# EAGLE design elasticNode (EAGLE 8.2.2)

## Sheet 1 of 4
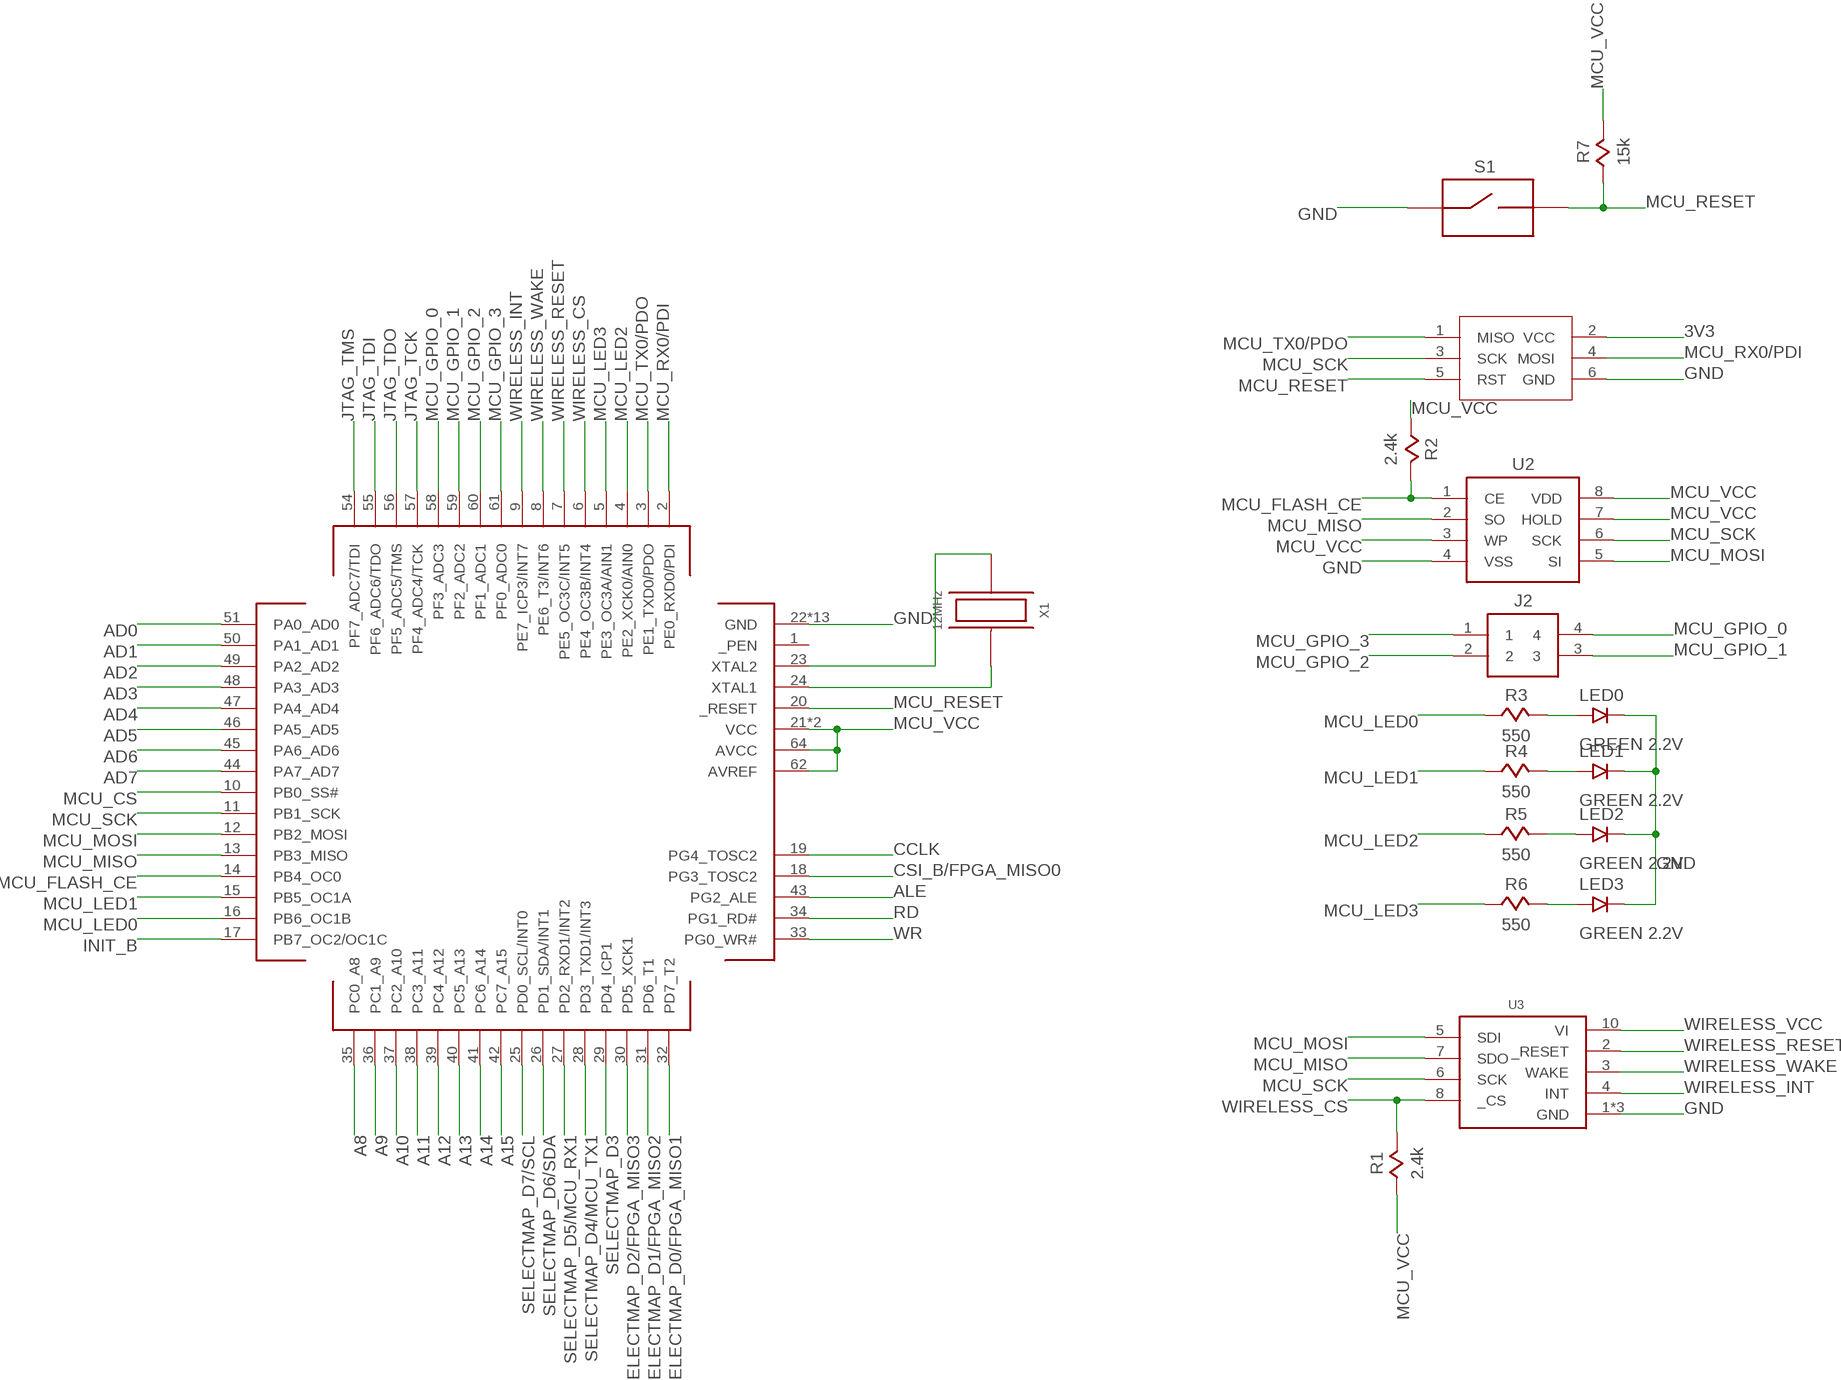
[diagram p0: schematic, sheet 1]

### Parts
J1  ISP_CONN_6PIN  [3X2_HEADER_SMT]
J2  FEMALE_HEADER_2X2  [2X2_HEADER]
LED0  GREEN 2.2V  LED  [0805]
LED1  GREEN 2.2V  LED  [0805]
LED2  GREEN 2.2V  LED  [0805]
LED3  GREEN 2.2V  LED  [0805]
R1  2.4k  RESISTOR  [0805]
R2  2.4k  RESISTOR  [0805]
R3  550  RESISTOR  [0805]
R4  550  RESISTOR  [0805]
R5  550  RESISTOR  [0805]
R6  550  RESISTOR  [0805]
R7  15k  RESISTOR  [0805]
S1  SPST_BUTTON2PIN_SMT  [SPST_2PIN_SMT]
U1  ATMEGA64AQFN  [QFN64]
U2  SST26VF032B  [SOIC8]
U3  MRF24J40MA  [MRF24J40MA]
X1  12MHz  QUARTZ  [3.2X2.5_OSC]

### Nets
3V3 [power]: J1.2(VCC) ; also sheet 2,3,4
A8: U1.35(PC0_A8) ; also sheet 2
A9: U1.36(PC1_A9) ; also sheet 2
A10: U1.37(PC2_A10) ; also sheet 2
A11: U1.38(PC3_A11) ; also sheet 2
A12: U1.39(PC4_A12) ; also sheet 2
A13: U1.40(PC5_A13) ; also sheet 2
A14: U1.41(PC6_A14) ; also sheet 2
A15: U1.42(PC7_A15) ; also sheet 2
AD0: U1.51(PA0_AD0) ; also sheet 2
AD1: U1.50(PA1_AD1) ; also sheet 2
AD2: U1.49(PA2_AD2) ; also sheet 2
AD3: U1.48(PA3_AD3) ; also sheet 2
AD4: U1.47(PA4_AD4) ; also sheet 2
AD5: U1.46(PA5_AD5) ; also sheet 2
AD6: U1.45(PA6_AD6) ; also sheet 2
AD7: U1.44(PA7_AD7) ; also sheet 2
ALE: U1.43(PG2_ALE) ; also sheet 2
CCLK: U1.19(PG4_TOSC2) ; also sheet 2
CSI_B/FPGA_MISO0: U1.18(PG3_TOSC2) ; also sheet 2
GND: J1.6(GND) LED0.2 LED1.2 LED2.2 LED3.2 S1.1 U1.22(GND) U1.53(GND) U1.63(GND) U1.PAD(GND) U1.VIA1(GND) U1.VIA2(GND) U1.VIA3(GND) U1.VIA4(GND) U1.VIA5(GND) U1.VIA6(GND) U1.VIA7(GND) U1.VIA8(GND) U1.VIA9(GND) U2.4(VSS) U3.1(GND) U3.11(GND) U3.12(GND) ; also sheet 2,3,4
INIT_B: U1.17(PB7_OC2/OC1C) ; also sheet 2
JTAG_TCK: U1.57(PF4_ADC4/TCK) ; also sheet 2
JTAG_TDI: U1.55(PF6_ADC6/TDO) ; also sheet 2
JTAG_TDO: U1.56(PF5_ADC5/TMS) ; also sheet 2
JTAG_TMS: U1.54(PF7_ADC7/TDI) ; also sheet 2
MCU_CS: U1.10(PB0_SS#)
MCU_FLASH_CE: R2.2 U1.14(PB4_OC0) U2.1(CE)
MCU_GPIO_0: J2.4 U1.58(PF3_ADC3)
MCU_GPIO_1: J2.3 U1.59(PF2_ADC2)
MCU_GPIO_2: J2.2 U1.60(PF1_ADC1)
MCU_GPIO_3: J2.1 U1.61(PF0_ADC0)
MCU_LED0: R3.1 U1.16(PB6_OC1B)
MCU_LED1: R4.1 U1.15(PB5_OC1A)
MCU_LED2: R5.1 U1.4(PE2_XCK0/AIN0)
MCU_LED3: R6.1 U1.5(PE3_OC3A/AIN1)
MCU_MISO: U1.13(PB3_MISO) U2.2(SO) U3.7(SDO)
MCU_MOSI: U1.12(PB2_MOSI) U2.5(SI) U3.5(SDI)
MCU_RESET: J1.5(RST) R7.1 S1.2 U1.20(_RESET)
MCU_RX0/PDI: J1.4(MOSI) U1.2(PE0_RXD0/PDI) ; also sheet 4
MCU_SCK: J1.3(SCK) U1.11(PB1_SCK) U2.6(SCK) U3.6(SCK)
MCU_TX0/PDO: J1.1(MISO) U1.3(PE1_TXD0/PDO) ; also sheet 4
MCU_VCC: R1.1 R2.1 R7.2 U1.21(VCC) U1.52(VCC) U1.62(AVREF) U1.64(AVCC) U2.3(WP) U2.7(HOLD) U2.8(VDD) ; also sheet 3
N$13: LED3.1 R6.2
N$15: LED2.1 R5.2
N$23: LED1.1 R4.2
N$24: LED0.1 R3.2
N$38: U1.23(XTAL2) X1.2
N$39: U1.24(XTAL1) X1.4
RD: U1.34(PG1_RD#) ; also sheet 2
SELECTMAP_D0/FPGA_MISO1: U1.32(PD7_T2) ; also sheet 2
SELECTMAP_D1/FPGA_MISO2: U1.31(PD6_T1) ; also sheet 2
SELECTMAP_D2/FPGA_MISO3: U1.30(PD5_XCK1) ; also sheet 2
SELECTMAP_D3: U1.29(PD4_ICP1) ; also sheet 2
SELECTMAP_D4/MCU_TX1: U1.28(PD3_TXD1/INT3) ; also sheet 2
SELECTMAP_D5/MCU_RX1: U1.27(PD2_RXD1/INT2) ; also sheet 2
SELECTMAP_D6/SDA: U1.26(PD1_SDA/INT1) ; also sheet 2,3
SELECTMAP_D7/SCL: U1.25(PD0_SCL/INT0) ; also sheet 2,3
WIRELESS_CS: R1.2 U1.6(PE4_OC3B/INT4) U3.8(_CS)
WIRELESS_INT: U1.9(PE7_ICP3/INT7) U3.4(INT)
WIRELESS_RESET: U1.7(PE5_OC3C/INT5) U3.2(_RESET)
WIRELESS_VCC [power]: U3.10(VI) ; also sheet 3
WIRELESS_WAKE: U1.8(PE6_T3/INT6) U3.3(WAKE)
WR: U1.33(PG0_WR#) ; also sheet 2
Unconnected: U1.1(_PEN)

## Sheet 2 of 4
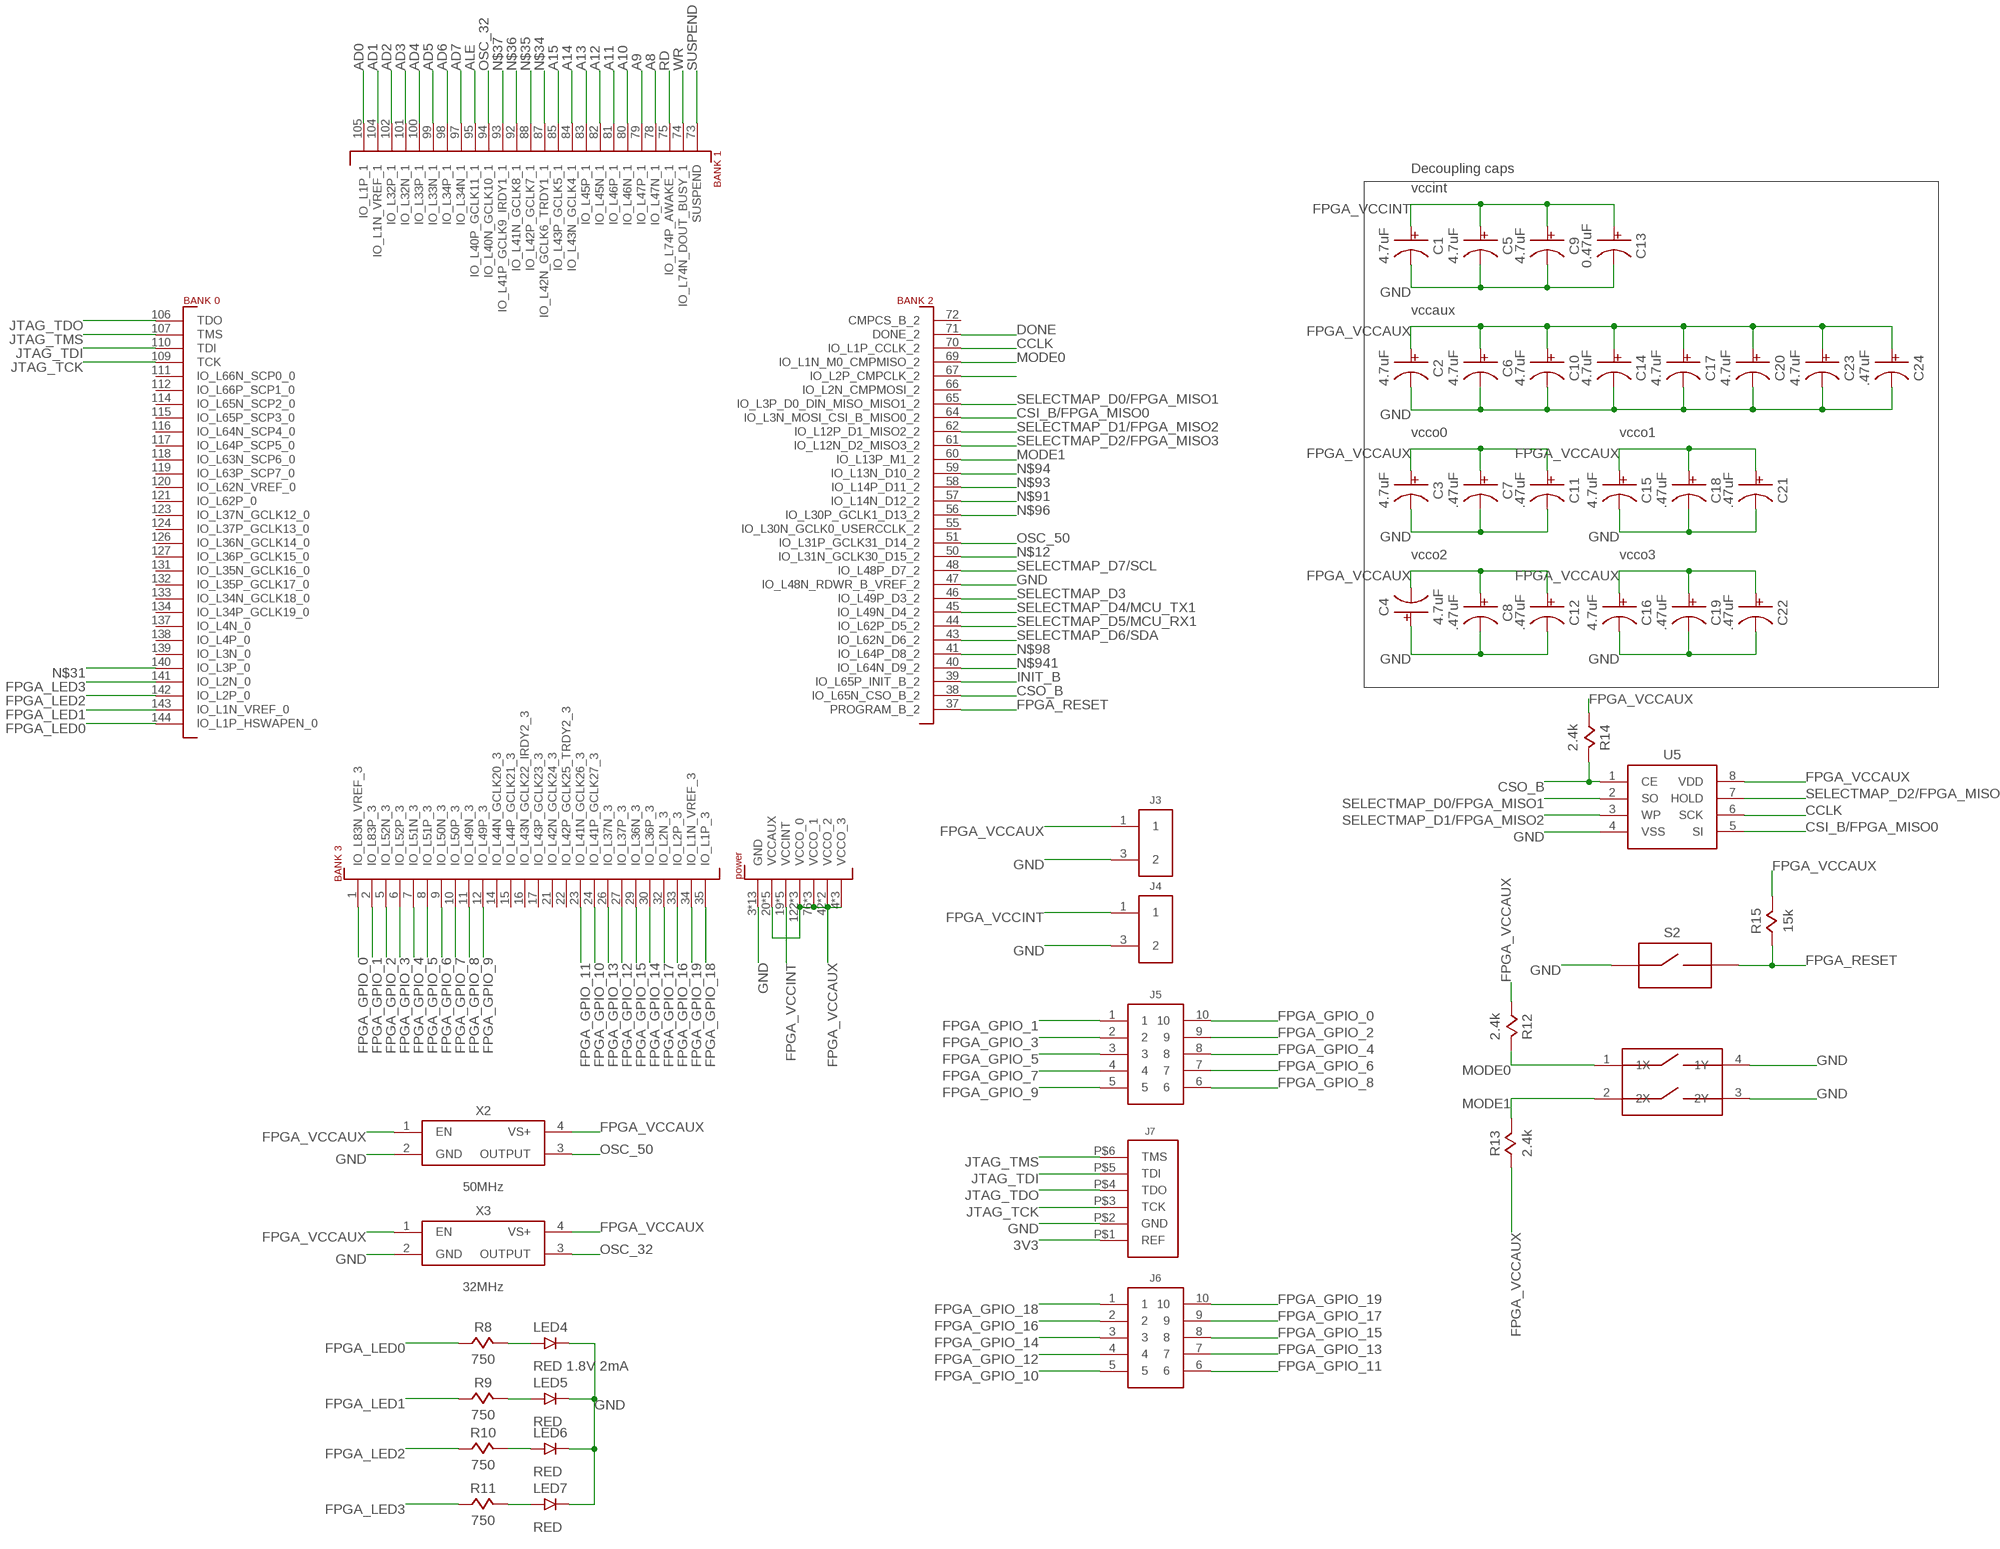
[diagram p1: schematic, sheet 2]

### Parts
C1  4.7uF  CAPACITOR0805  [0805]
C2  4.7uF  CAPACITOR0805  [0805]
C3  4.7uF  CAPACITOR0805  [0805]
C4  4.7uF  CAPACITOR0805  [0805]
C5  4.7uF  CAPACITOR0805  [0805]
C6  4.7uF  CAPACITOR0805  [0805]
C7  .47uF  CAPACITOR0402  [0402]
C8  .47uF  CAPACITOR0402  [0402]
C9  4.7uF  CAPACITOR0805  [0805]
C10  4.7uF  CAPACITOR0805  [0805]
C11  .47uF  CAPACITOR0402  [0402]
C12  .47uF  CAPACITOR0402  [0402]
C13  0.47uF  CAPACITOR0402  [0402]
C14  4.7uF  CAPACITOR0805  [0805]
C15  4.7uF  CAPACITOR0805  [0805]
C16  4.7uF  CAPACITOR0805  [0805]
C17  4.7uF  CAPACITOR0805  [0805]
C18  .47uF  CAPACITOR0402  [0402]
C19  .47uF  CAPACITOR0402  [0402]
C20  4.7uF  CAPACITOR0805  [0805]
C21  .47uF  CAPACITOR0402  [0402]
C22  .47uF  CAPACITOR0402  [0402]
C23  4.7uF  CAPACITOR0805  [0805]
C24  .47uF  CAPACITOR0805  [0805]
J3  FEMALE_HEADER_2X1  [2X1_HEADER]
J4  FEMALE_HEADER_2X1  [2X1_HEADER]
J5  FEMALE_HEADER_5X2  [5X2_HEADER]
J6  FEMALE_HEADER_5X2  [5X2_HEADER]
J7  JTAG_CONN_6PINTHT  [6X1_HEADER]
LED4  RED 1.8V 2mA  LED  [0805]
LED5  RED  LED  [0805]
LED6  RED  LED  [0805]
LED7  RED  LED  [0805]
R8  750  RESISTOR  [0805]
R9  750  RESISTOR  [0805]
R10  750  RESISTOR  [0805]
R11  750  RESISTOR  [0805]
R12  2.4k  RESISTOR  [0805]
R13  2.4k  RESISTOR  [0805]
R14  2.4k  RESISTOR  [0805]
R15  15k  RESISTOR  [0805]
S2  SPST_BUTTON2PIN_SMT  [SPST_2PIN_SMT]
S3  SPST_DIP_2SMT  [SPST_DIP2_SMT]
U4  SPARTAN6-LX9  [TQG144]
U5  SST26VF032B  [SOIC8]
X2  50MHz  OSCILLATOR3.2X2.5  [3.2X2.5_OSC]
X3  32MHz  OSCILLATOR3.2X2.5  [3.2X2.5_OSC]

### Nets
3V3 [power]: J7.P$1(REF) ; also sheet 1,3,4
A8: U4.78(IO_L47N_1) ; also sheet 1
A9: U4.79(IO_L47P_1) ; also sheet 1
A10: U4.80(IO_L46N_1) ; also sheet 1
A11: U4.81(IO_L46P_1) ; also sheet 1
A12: U4.82(IO_L45N_1) ; also sheet 1
A13: U4.83(IO_L45P_1) ; also sheet 1
A14: U4.84(IO_L43N_GCLK4_1) ; also sheet 1
A15: U4.85(IO_L43P_GCLK5_1) ; also sheet 1
AD0: U4.105(IO_L1P_1) ; also sheet 1
AD1: U4.104(IO_L1N_VREF_1) ; also sheet 1
AD2: U4.102(IO_L32P_1) ; also sheet 1
AD3: U4.101(IO_L32N_1) ; also sheet 1
AD4: U4.100(IO_L33P_1) ; also sheet 1
AD5: U4.99(IO_L33N_1) ; also sheet 1
AD6: U4.98(IO_L34P_1) ; also sheet 1
AD7: U4.97(IO_L34N_1) ; also sheet 1
ALE: U4.95(IO_L40P_GCLK11_1) ; also sheet 1
CCLK: U4.70(IO_L1P_CCLK_2) U5.6(SCK) ; also sheet 1
CSI_B/FPGA_MISO0: U4.64(IO_L3N_MOSI_CSI_B_MISO0_2) U5.5(SI) ; also sheet 1
CSO_B: R14.2 U4.38(IO_L65N_CSO_B_2) U5.1(CE)
DONE: U4.71(DONE_2)
FPGA_GPIO_0: J5.10 U4.1(IO_L83N_VREF_3)
FPGA_GPIO_1: J5.1 U4.2(IO_L83P_3)
FPGA_GPIO_2: J5.9 U4.5(IO_L52N_3)
FPGA_GPIO_3: J5.2 U4.6(IO_L52P_3)
FPGA_GPIO_4: J5.8 U4.7(IO_L51N_3)
FPGA_GPIO_5: J5.3 U4.8(IO_L51P_3)
FPGA_GPIO_6: J5.7 U4.9(IO_L50N_3)
FPGA_GPIO_7: J5.4 U4.10(IO_L50P_3)
FPGA_GPIO_8: J5.6 U4.11(IO_L49N_3)
FPGA_GPIO_9: J5.5 U4.12(IO_L49P_3)
FPGA_GPIO_10: J6.5 U4.24(IO_L41P_GCLK27_3)
FPGA_GPIO_11: J6.6 U4.23(IO_L41N_GCLK26_3)
FPGA_GPIO_12: J6.4 U4.27(IO_L37P_3)
FPGA_GPIO_13: J6.7 U4.26(IO_L37N_3)
FPGA_GPIO_14: J6.3 U4.30(IO_L36P_3)
FPGA_GPIO_15: J6.8 U4.29(IO_L36N_3)
FPGA_GPIO_16: J6.2 U4.33(IO_L2P_3)
FPGA_GPIO_17: J6.9 U4.32(IO_L2N_3)
FPGA_GPIO_18: J6.1 U4.35(IO_L1P_3)
FPGA_GPIO_19: J6.10 U4.34(IO_L1N_VREF_3)
FPGA_LED0: R8.1 U4.144(IO_L1P_HSWAPEN_0)
FPGA_LED1: R9.1 U4.143(IO_L1N_VREF_0)
FPGA_LED2: R10.1 U4.142(IO_L2P_0)
FPGA_LED3: R11.1 U4.141(IO_L2N_0)
FPGA_RESET: R15.1 S2.2 U4.37(PROGRAM_B_2)
FPGA_VCCAUX: C2.1 C3.1 C4.2 C6.1 C7.1 C8.1 C10.1 C11.1 C12.1 C14.1 C15.1 C16.1 C17.1 C18.1 C19.1 C20.1 C21.1 C22.1 C23.1 C24.1 J3.1 R12.1 R13.1 R14.1 R15.2 U4.4(VCCO_3) U4.18(VCCO_3) U4.20(VCCAUX) U4.31(VCCO_3) U4.36(VCCAUX) U4.42(VCCO_2) U4.53(VCCAUX) U4.63(VCCO_2) U4.76(VCCO_1) U4.86(VCCO_1) U4.90(VCCAUX) U4.103(VCCO_1) U4.122(VCCO_0) U4.125(VCCO_0) U4.129(VCCAUX) U4.135(VCCO_0) U5.8(VDD) X2.1(EN) X2.4(VS+) X3.1(EN) X3.4(VS+) ; also sheet 3
FPGA_VCCINT [power]: C1.1 C5.1 C9.1 C13.1 J4.1 U4.19(VCCINT) U4.28(VCCINT) U4.52(VCCINT) U4.89(VCCINT) U4.128(VCCINT) ; also sheet 3
GND: C1.2 C2.2 C3.2 C4.1 C5.2 C6.2 C7.2 C8.2 C9.2 C10.2 C11.2 C12.2 C13.2 C14.2 C15.2 C16.2 C17.2 C18.2 C19.2 C20.2 C21.2 C22.2 C23.2 C24.2 J3.3 J4.3 J7.P$2(GND) LED4.2 LED5.2 LED6.2 LED7.2 S2.1 S3.3(2Y) S3.4(1Y) U4.3(GND) U4.13(GND) U4.25(GND) U4.47(IO_L48N_RDWR_B_VREF_2) U4.49(GND) U4.54(GND) U4.68(GND) U4.77(GND) U4.91(GND) U4.96(GND) U4.108(GND) U4.113(GND) U4.130(GND) U4.136(GND) U5.4(VSS) X2.2(GND) X3.2(GND) ; also sheet 1,3,4
INIT_B: U4.39(IO_L65P_INIT_B_2) ; also sheet 1
JTAG_TCK: J7.P$3(TCK) U4.109(TCK) ; also sheet 1
JTAG_TDI: J7.P$5(TDI) U4.110(TDI) ; also sheet 1
JTAG_TDO: J7.P$4(TDO) U4.106(TDO) ; also sheet 1
JTAG_TMS: J7.P$6(TMS) U4.107(TMS) ; also sheet 1
MODE0: R12.2 S3.1(1X) U4.69(IO_L1N_M0_CMPMISO_2)
MODE1: R13.2 S3.2(2X) U4.60(IO_L13P_M1_2)
N$9: U4.67(IO_L2P_CMPCLK_2)
N$12: U4.50(IO_L31N_GCLK30_D15_2)
N$25: LED7.1 R11.2
N$27: LED6.1 R10.2
N$29: LED5.1 R9.2
N$30: LED4.1 R8.2
N$31: U4.140(IO_L3P_0)
N$34: U4.87(IO_L42N_GCLK6_TRDY1_1)
N$35: U4.88(IO_L42P_GCLK7_1)
N$36: U4.92(IO_L41N_GCLK8_1)
N$37: U4.93(IO_L41P_GCLK9_IRDY1_1)
N$91: U4.57(IO_L14N_D12_2)
N$93: U4.58(IO_L14P_D11_2)
N$94: U4.59(IO_L13N_D10_2)
N$96: U4.56(IO_L30P_GCLK1_D13_2)
N$98: U4.41(IO_L64P_D8_2)
N$941: U4.40(IO_L64N_D9_2)
OSC_32: U4.94(IO_L40N_GCLK10_1) X3.3(OUTPUT)
OSC_50: U4.51(IO_L31P_GCLK31_D14_2) X2.3(OUTPUT)
RD: U4.75(IO_L74P_AWAKE_1) ; also sheet 1
SELECTMAP_D0/FPGA_MISO1: U4.65(IO_L3P_D0_DIN_MISO_MISO1_2) U5.2(SO) ; also sheet 1
SELECTMAP_D1/FPGA_MISO2: U4.62(IO_L12P_D1_MISO2_2) U5.3(WP) ; also sheet 1
SELECTMAP_D2/FPGA_MISO3: U4.61(IO_L12N_D2_MISO3_2) U5.7(HOLD) ; also sheet 1
SELECTMAP_D3: U4.46(IO_L49P_D3_2) ; also sheet 1
SELECTMAP_D4/MCU_TX1: U4.45(IO_L49N_D4_2) ; also sheet 1
SELECTMAP_D5/MCU_RX1: U4.44(IO_L62P_D5_2) ; also sheet 1
SELECTMAP_D6/SDA: U4.43(IO_L62N_D6_2) ; also sheet 1,3
SELECTMAP_D7/SCL: U4.48(IO_L48P_D7_2) ; also sheet 1,3
SUSPEND: U4.73(SUSPEND)
WR: U4.74(IO_L74N_DOUT_BUSY_1) ; also sheet 1
Unconnected: U4.14(IO_L44N_GCLK20_3) U4.15(IO_L44P_GCLK21_3) U4.16(IO_L43N_GCLK22_IRDY2_3) U4.17(IO_L43P_GCLK23_3) U4.21(IO_L42N_GCLK24_3) U4.22(IO_L42P_GCLK25_TRDY2_3) U4.55(IO_L30N_GCLK0_USERCCLK_2) U4.66(IO_L2N_CMPMOSI_2) U4.72(CMPCS_B_2) U4.111(IO_L66N_SCP0_0) U4.112(IO_L66P_SCP1_0) U4.114(IO_L65N_SCP2_0) U4.115(IO_L65P_SCP3_0) U4.116(IO_L64N_SCP4_0) U4.117(IO_L64P_SCP5_0) U4.118(IO_L63N_SCP6_0) U4.119(IO_L63P_SCP7_0) U4.120(IO_L62N_VREF_0) U4.121(IO_L62P_0) U4.123(IO_L37N_GCLK12_0) U4.124(IO_L37P_GCLK13_0) U4.126(IO_L36N_GCLK14_0) U4.127(IO_L36P_GCLK15_0) U4.131(IO_L35N_GCLK16_0) U4.132(IO_L35P_GCLK17_0) U4.133(IO_L34N_GCLK18_0) U4.134(IO_L34P_GCLK19_0) U4.137(IO_L4N_0) U4.138(IO_L4P_0) U4.139(IO_L3N_0)

### Notes on the sheet
- Decoupling caps
- vccint
- vccaux
- vcco0 | vcco1
- vcco2 | vcco3

## Sheet 3 of 4
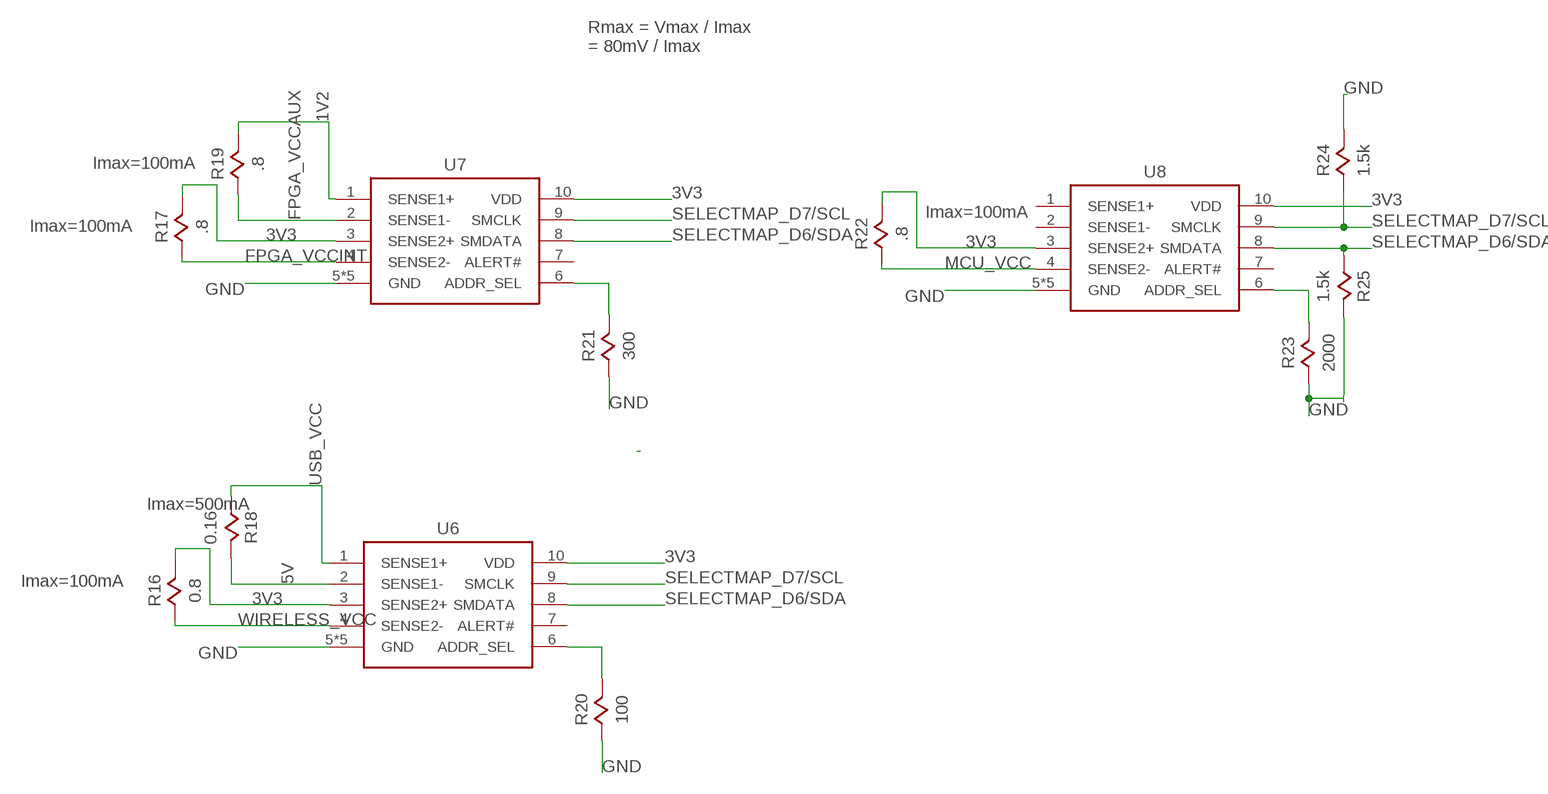
[diagram p2: schematic, sheet 3]

### Parts
R16  0.8  RESISTOR  [0805]
R17  .8  RESISTOR  [0805]
R18  0.16  RESISTOR  [0805]
R19  .8  RESISTOR  [0805]
R20  100  RESISTOR  [0805]
R21  300  RESISTOR  [0805]
R22  .8  RESISTOR  [0805]
R23  2000  RESISTOR  [0805]
R24  1.5k  RESISTOR  [0805]
R25  1.5k  RESISTOR  [0805]
U6  PAC1720  [VDFN10]
U7  PAC1720  [VDFN10]
U8  PAC1720  [VDFN10]

### Nets
1V2 [power]: R19.2 U7.1(SENSE1+) ; also sheet 4
3V3 [power]: R16.2 R17.2 R22.2 U6.3(SENSE2+) U6.10(VDD) U7.3(SENSE2+) U7.10(VDD) U8.3(SENSE2+) U8.10(VDD) ; also sheet 1,2,4
5V [power]: R18.2 U6.2(SENSE1-) ; also sheet 4
FPGA_VCCAUX: R19.1 U7.2(SENSE1-) ; also sheet 2
FPGA_VCCINT [power]: R17.1 U7.4(SENSE2-) ; also sheet 2
GND: R20.1 R21.1 R23.1 R24.2 U6.5(GND) U6.P$1(GND) U6.P$2(GND) U6.P$3(GND) U6.P$4(GND) U7.5(GND) U7.P$1(GND) U7.P$2(GND) U7.P$3(GND) U7.P$4(GND) U8.5(GND) U8.P$1(GND) U8.P$2(GND) U8.P$3(GND) U8.P$4(GND) ; also sheet 1,2,4
MCU_VCC: R22.1 U8.4(SENSE2-) ; also sheet 1
N$16: R23.2 U8.6(ADDR_SEL)
N$28: R21.2 U7.6(ADDR_SEL)
N$32: R20.2 U6.6(ADDR_SEL)
N$33: R25.2
SELECTMAP_D6/SDA: R25.1 U6.8(SMDATA) U7.8(SMDATA) U8.8(SMDATA) ; also sheet 1,2
SELECTMAP_D7/SCL: R24.1 U6.9(SMCLK) U7.9(SMCLK) U8.9(SMCLK) ; also sheet 1,2
USB_VCC: R18.1 U6.1(SENSE1+) ; also sheet 4
WIRELESS_VCC [power]: R16.1 U6.4(SENSE2-) ; also sheet 1
Unconnected: U6.7(ALERT#) U7.7(ALERT#) U8.1(SENSE1+) U8.2(SENSE1-) U8.7(ALERT#)

### Notes on the sheet
- Rmax = Vmax / Imax
  = 80mV / Imax
- Imax=100mA
- Imax=100mA
- Imax=100mA
- Imax=500mA
- Imax=100mA

## Sheet 4 of 4
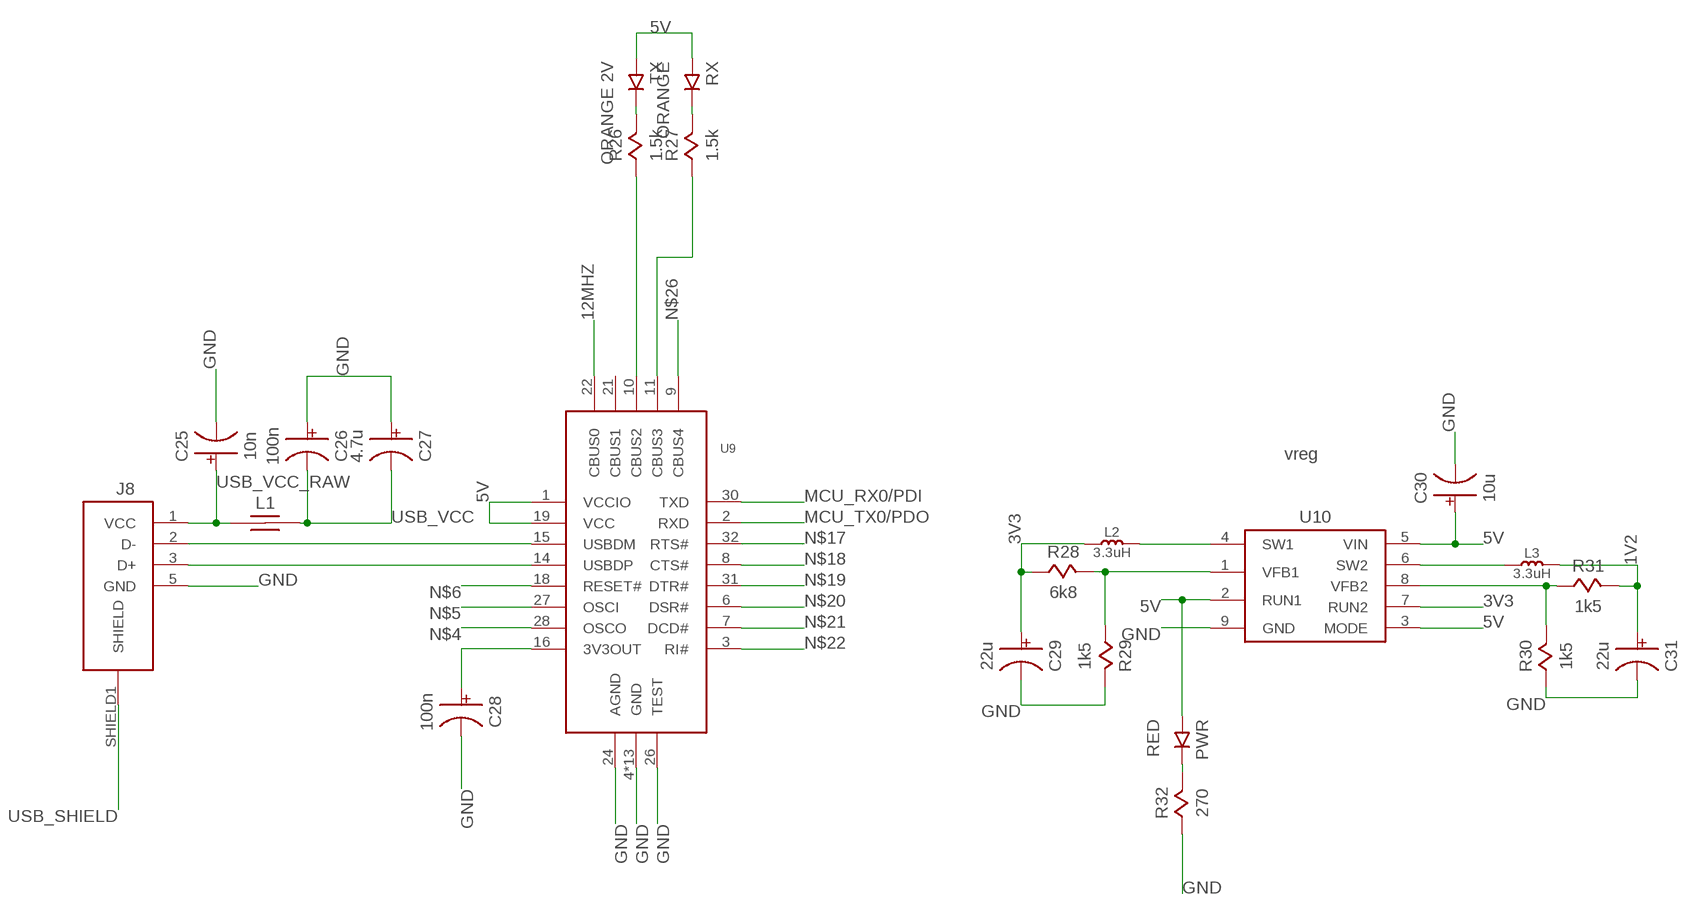
[diagram p3: schematic, sheet 4]

### Parts
C25  10n  CAPACITOR0805  [0805]
C26  100n  CAPACITOR0805  [0805]
C27  4.7u  CAPACITOR0805  [0805]
C28  100n  CAPACITOR0805  [0805]
C29  22u  CAPACITOR0805  [0805]
C30  10u  CAPACITOR0805  [0805]
C31  22u  CAPACITOR0805  [0805]
J8  USB_CONN  [USB_MICRO_B]
L1  40Ohm 1.5A  FERRITE_BEAD  [0805]
L2  3.3uH  INDUCTOR  [0805]
L3  3.3uH  INDUCTOR  [0805]
PWR  RED  LED  [0805]
R26  1.5k  RESISTOR  [0805]
R27  1.5k  RESISTOR  [0805]
R28  6k8  RESISTOR  [0805]
R29  1k5  RESISTOR  [0805]
R30  1k5  RESISTOR  [0805]
R31  1k5  RESISTOR  [0805]
R32  270  RESISTOR  [0805]
RX  ORANGE  LED  [0805]
TX  ORANGE 2V  LED  [0805]
U9  FT232R  [QFN32]
U10  LTC3419DFN  [DFN8]

### Nets
1V2 [power]: C31.1 L3.2 R31.2 ; also sheet 3
3V3 [power]: C29.1 L2.1 R28.1 U10.7(RUN2) ; also sheet 1,2,3
5V [power]: C30.1 PWR.1 RX.1 TX.1 U9.1(VCCIO) U9.19(VCC) U10.2(RUN1) U10.3(MODE) U10.5(VIN) ; also sheet 3
12MHZ: U9.22(CBUS0)
FTDI_RXLED: R27.1 U9.11(CBUS3)
GND: C25.2 C26.1 C27.1 C28.2 C29.2 C30.2 C31.2 J8.5(GND) R29.2 R30.1 R32.1 U9.4(GND) U9.17(GND) U9.20(GND) U9.24(AGND) U9.26(TEST) U9.33(GND) U9.P$1(GND) U9.P$2(GND) U9.P$3(GND) U9.P$4(GND) U9.P$5(GND) U9.P$6(GND) U9.P$7(GND) U9.P$8(GND) U9.P$9(GND) U10.9(GND) ; also sheet 1,2,3
MCU_RX0/PDI: U9.30(TXD) ; also sheet 1
MCU_TX0/PDO: U9.2(RXD) ; also sheet 1
N$1: L2.2 U10.4(SW1)
N$2: R28.2 R29.1 U10.1(VFB1)
N$3: C28.1 U9.16(3V3OUT)
N$4: U9.28(OSCO)
N$5: U9.27(OSCI)
N$6: U9.18(RESET#)
N$7: R30.2 R31.1 U10.8(VFB2)
N$8: L3.1 U10.6(SW2)
N$10: R26.1 U9.10(CBUS2)
N$11: R26.2 TX.2
N$14: R27.2 RX.2
N$17: U9.32(RTS#)
N$18: U9.8(CTS#)
N$19: U9.31(DTR#)
N$20: U9.6(DSR#)
N$21: U9.7(DCD#)
N$22: U9.3(RI#)
N$26: U9.9(CBUS4)
N$41: PWR.2 R32.2
USB_SHIELD: J8.SHIELD1(SHIELD)
USB_VCC: C26.2 C27.2 L1.2 ; also sheet 3
USB_VCC_RAW: C25.1 J8.1(VCC) L1.1
USBD+: J8.3(D+) U9.14(USBDP)
USBD-: J8.2(D-) U9.15(USBDM)
Unconnected: U9.21(CBUS1)

### Notes on the sheet
- vreg

## Library data of the parts
C1-C31 = passive:CAPACITOR
J1 = connectors:ISP_CONN_6PIN
J2 = connectors:FEMALE_HEADER_2X2
J3 J4 = connectors:FEMALE_HEADER_2X1
J5 J6 = connectors:FEMALE_HEADER_5X2
J7 = connectors:JTAG_CONN_6PIN
J8 = connectors:USB_CONN
L1 = passive:FERRITE_BEAD
L2 L3 = passive:INDUCTOR
LED0 LED1-LED7 PWR RX TX = opto:LED
R1-R32 = passive:RESISTOR
S1 S2 = connectors:SPST_BUTTON
S3 = connectors:SPST_DIP_2
U1 = ic:ATMEGA64A
U2 U5 = ic:SST26VF032B
U3 = wireless:MRF24J40MA
U4 = fpga:SPARTAN6-LX9
U6-U8 = sensors:PAC1720
U9 = ic:FT232R
U10 = power:LTC3419
X1 = passive:QUARTZ
X2 X3 = passive:OSCILLATOR

## Board
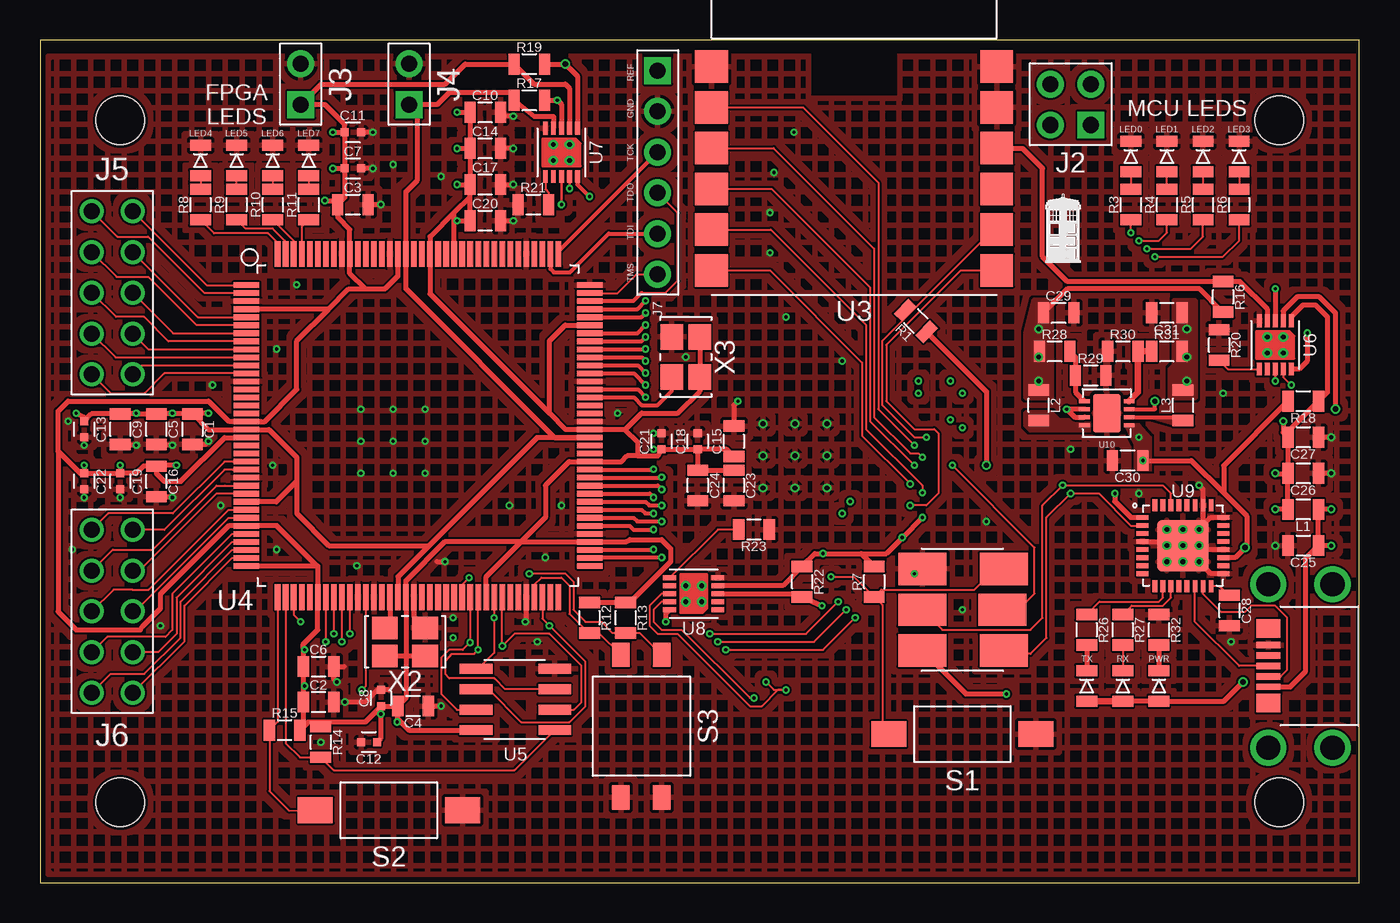
[diagram p4: board, top side]
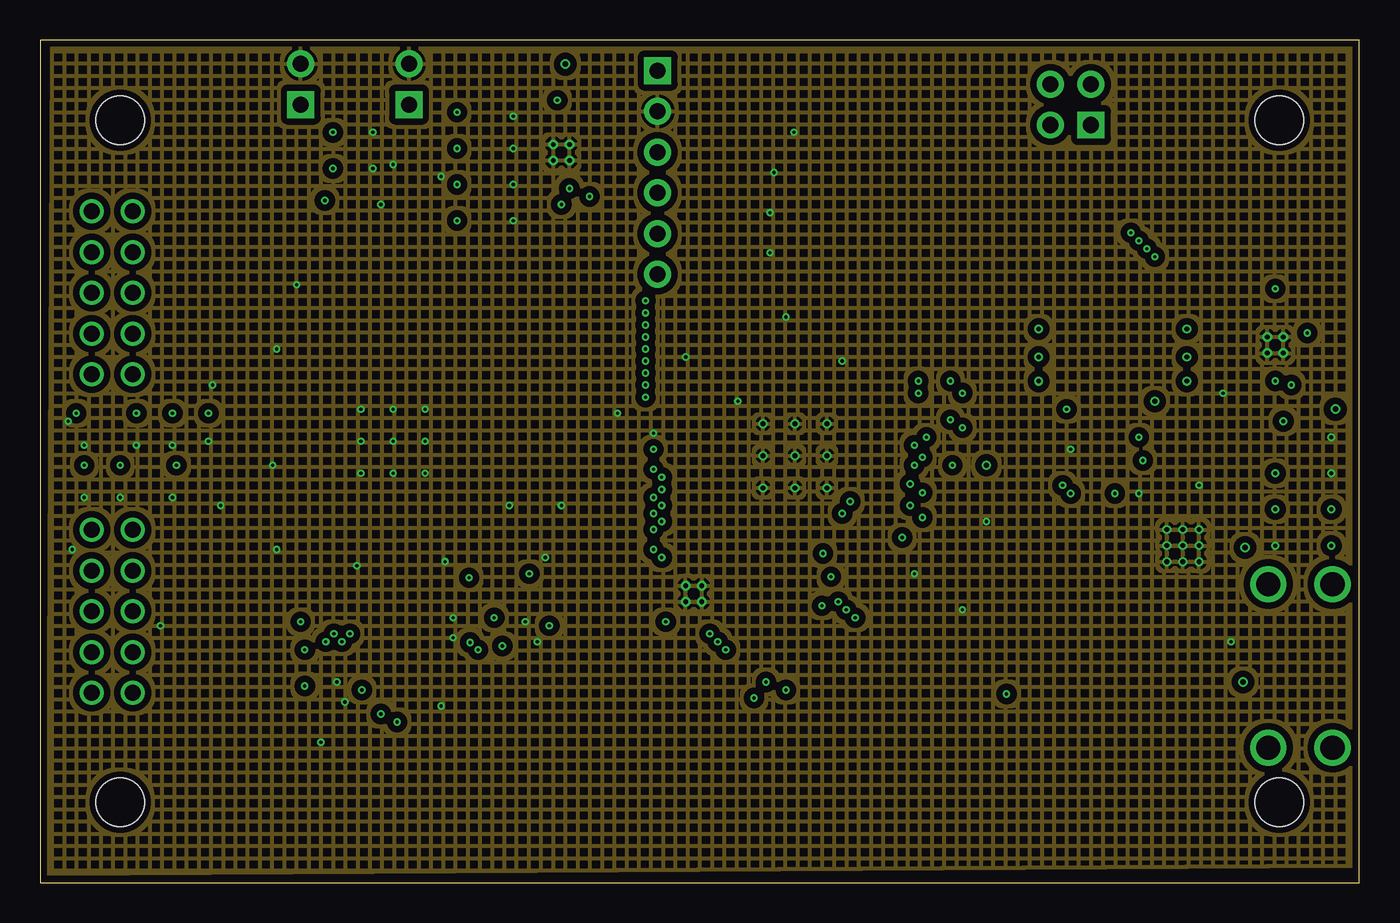
[diagram p5: board, inner layer GroundPlane]
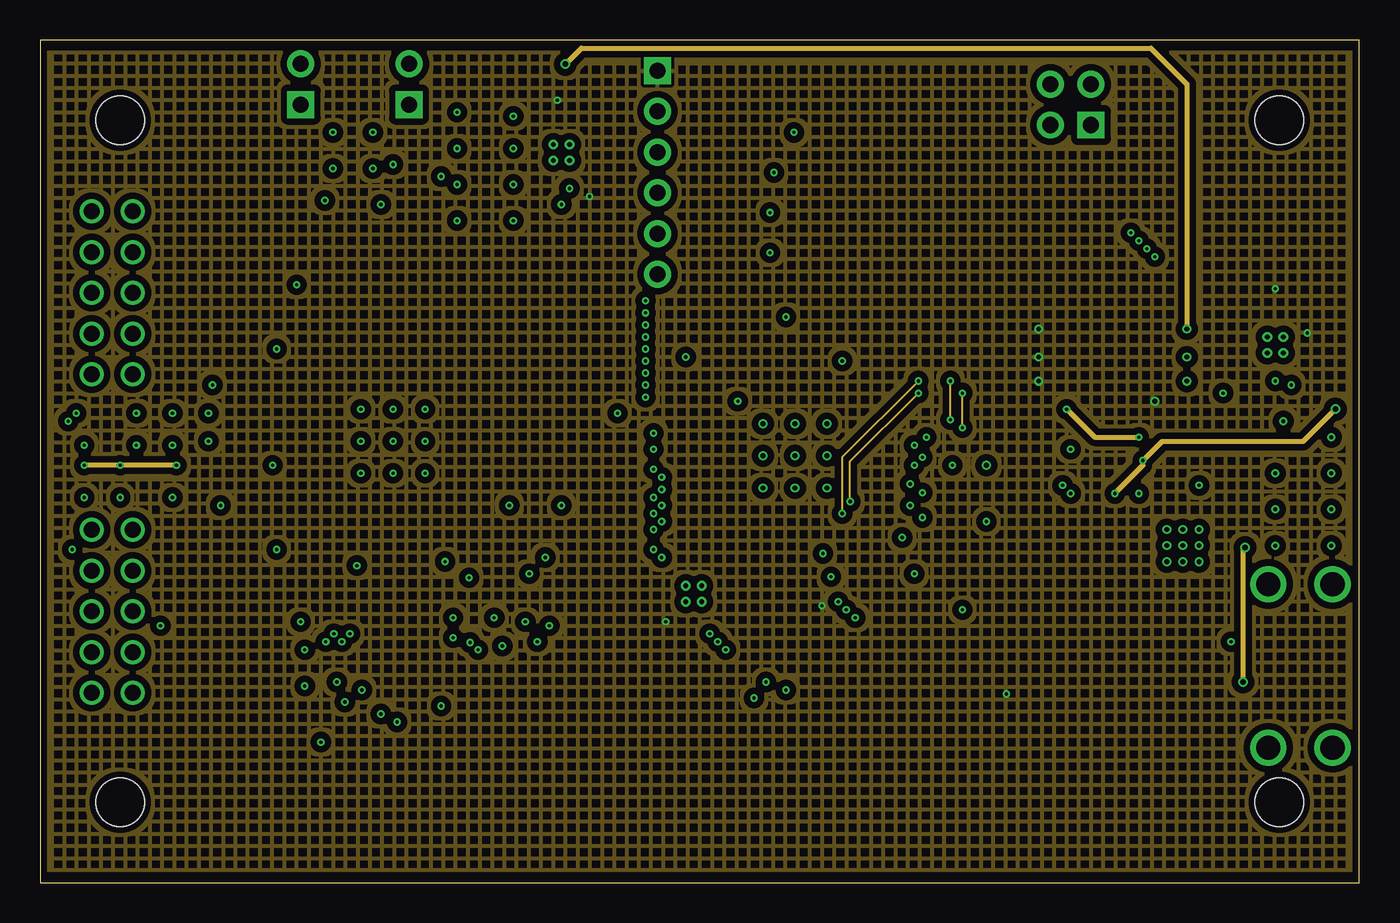
[diagram p6: board, inner layer PowerPlane]
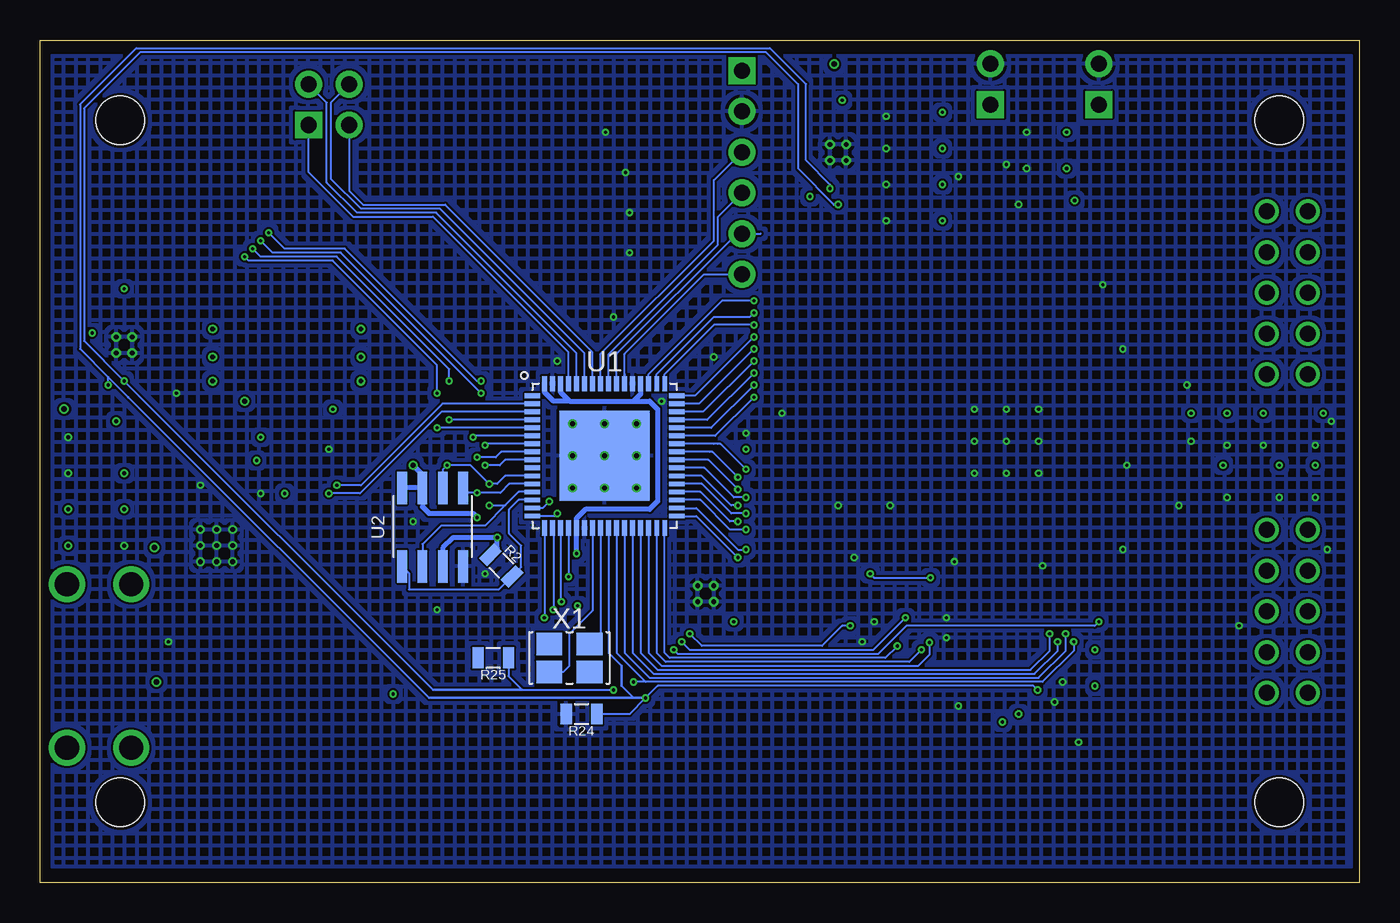
[diagram p7: board, bottom side, seen from below]

Size 82.25 x 52.5 mm. Coordinates in mm from the lower left corner, seen from the top.
Outline: 0,0 82.25,0 82.25,52.5 0,52.5 0,0
Copper layers (1+2*3+16): Top 0.018mm / dielectric 0.36mm / GroundPlane 0.035mm / dielectric 0.71mm / PowerPlane 0.035mm / dielectric 0.36mm / Bottom 0.018mm
Design rules "Multi-CB_4L_125um-Tracks_OL35um-IL35um": minimum track width 0.125mm, minimum drill 0.2mm, track to track 0.125mm, track to pad 0.125mm, pad to pad 0.125mm, via to via 0.125mm, smd to smd 0mil, copper to edge 0.2mm, drill to drill 0.2mm, minimum pad ring 0.125mm, minimum via ring 0.125mm, stop-mask expansion 2mil, vias tented up to drill 0.45mm, thermal gap 0.2mm
Holes 3 mm at 77.25,47.5 77.25,5 5,5 5,47.5

### Footprints (pad centres in the part's own frame; a part is rotated, then mirrored left to right if it is on the bottom)
0805 = smd 0.7 x 1.3: 1 -0.95,0; 2 0.95,0
0402 = smd 0.5 x 0.5: 1 -0.5,0; 2 0.5,0
3X2_HEADER_SMT = smd 2 x 3: 1 -2.54,-2.58; 2 -2.54,2.5; 3 0,-2.5; 4 0,2.5; 5 2.54,-2.58; 6 2.54,2.5
2X2_HEADER = drill 1 pad 1.676 square: 1 -1.27,1.29 | drill 1 pad 1.676: 2 -1.27,-1.25; 3 1.27,-1.25; 4 1.27,1.29
2X1_HEADER = drill 1 pad 1.676 square: 1 0,1.27 | drill 1 pad 1.676: 3 0,-1.27
5X2_HEADER = drill 1: 1 -5.08,-1.27; 2 -2.54,-1.27; 3 0,-1.27; 4 2.54,-1.27; 5 5.08,-1.27; 6 5.08,1.27; 7 2.54,1.27; 8 0,1.27; 9 -2.54,1.27; 10 -5.08,1.27
6X1_HEADER = drill 1 pad 1.676 square: P$1 -6.35,0 | drill 1 pad 1.676: P$2 -3.81,0; P$3 -1.27,0; P$4 1.27,0; P$5 3.81,0; P$6 6.35,0
USB_MICRO_B = smd 0.4 x 1.5: 1 -1.3,3.175; 2 -0.65,3.175; 3 0,3.175; 4 0.65,3.175; 5 1.3,3.175 | drill 1.5 pad 2.2: P$8 5.1,3.175; P$9 -5.1,3.175; P$10 5.1,-0.825; P$11 -5.1,-0.825 | smd 1.15 x 1.5: SHIELD1 -2.325,3.175; SHIELD2 2.325,3.175
SPST_2PIN_SMT = smd 2.18 x 1.6: 1 -4.59,0; 2 4.59,0
SPST_DIP2_SMT = smd 1.1 x 1.5: 1 -1.29,4.45; 2 1.25,4.45; 3 1.25,-4.45; 4 -1.29,-4.45
QFN64 = smd 0.95 x 0.3: 1 -4.5,3.75; 2 -4.5,3.25; 3 -4.5,2.75; 4 -4.5,2.25; 5 -4.5,1.75; 6 -4.5,1.25; 7 -4.5,0.75; 8 -4.5,0.25; 9 -4.5,-0.25; 10 -4.5,-0.75; 11 -4.5,-1.25; 12 -4.5,-1.75; 13 -4.5,-2.25; 14 -4.5,-2.75; 15 -4.5,-3.25; 16 -4.5,-3.75; 33 4.5,-3.75; 34 4.5,-3.25; 35 4.5,-2.75; 36 4.5,-2.25; 37 4.5,-1.75; 38 4.5,-1.25; 39 4.5,-0.75; 40 4.5,-0.25; 41 4.5,0.25; 42 4.5,0.75; 43 4.5,1.25; 44 4.5,1.75; 45 4.5,2.25; 46 4.5,2.75; 47 4.5,3.25; 48 4.5,3.75 | smd 0.3 x 0.95: 17 -3.75,-4.5; 18 -3.25,-4.5; 19 -2.75,-4.5; 20 -2.25,-4.5; 21 -1.75,-4.5; 22 -1.25,-4.5; 23 -0.75,-4.5; 24 -0.25,-4.5; 25 0.25,-4.5; 26 0.75,-4.5; 27 1.25,-4.5; 28 1.75,-4.5; 29 2.25,-4.5; 30 2.75,-4.5; 31 3.25,-4.5; 32 3.75,-4.5; 49 3.75,4.5; 50 3.25,4.5; 51 2.75,4.5; 52 2.25,4.5; 53 1.75,4.5; 54 1.25,4.5; 55 0.75,4.5; 56 0.25,4.5; 57 -0.25,4.5; 58 -0.75,4.5; 59 -1.25,4.5; 60 -1.75,4.5; 61 -2.25,4.5; 62 -2.75,4.5; 63 -3.25,4.5; 64 -3.75,4.5 | smd 5.6 x 5.6: PAD 0,0 | drill 0.3: VIA1 -2,2; VIA2 0,2; VIA3 2,2; VIA4 -2,0; VIA5 0,0; VIA6 2,0; VIA7 -2,-2; VIA8 0,-2; VIA9 2,-2
SOIC8 = smd 2.03 x 0.61: 1 -2.45,1.905; 2 -2.45,0.635; 3 -2.45,-0.635; 4 -2.45,-1.905; 5 2.45,-1.905; 6 2.45,-0.635; 7 2.45,0.635; 8 2.45,1.905
MRF24J40MA = smd 2.032 x 2.032: 1 -8.89,6.35; 2 -8.89,3.81; 3 -8.89,1.27; 4 -8.89,-1.27; 5 -8.89,-3.81; 6 -8.89,-6.35; 7 8.89,-6.35; 8 8.89,-3.81; 9 8.89,-1.27; 10 8.89,1.27; 11 8.89,3.81; 12 8.89,6.35
TQG144 = smd 1.6 x 0.35: 1 -10.7,8.75; 2 -10.7,8.25; 3 -10.7,7.75; 4 -10.7,7.25; 5 -10.7,6.75; 6 -10.7,6.25; 7 -10.7,5.75; 8 -10.7,5.25; 9 -10.7,4.75; 10 -10.7,4.25; 11 -10.7,3.75; 12 -10.7,3.25; 13 -10.7,2.75; 14 -10.7,2.25; 15 -10.7,1.75; 16 -10.7,1.25; 17 -10.7,0.75; 18 -10.7,0.25; 19 -10.7,-0.25; 20 -10.7,-0.75; 21 -10.7,-1.25; 22 -10.7,-1.75; 23 -10.7,-2.25; 24 -10.7,-2.75; 25 -10.7,-3.25; 26 -10.7,-3.75; 27 -10.7,-4.25; 28 -10.7,-4.75; 29 -10.7,-5.25; 30 -10.7,-5.75; 31 -10.7,-6.25; 32 -10.7,-6.75; 33 -10.7,-7.25; 34 -10.7,-7.75; 35 -10.7,-8.25; 36 -10.7,-8.75; 73 10.7,-8.75; 74 10.7,-8.25; 75 10.7,-7.75; 76 10.7,-7.25; 77 10.7,-6.75; 78 10.7,-6.25; 79 10.7,-5.75; 80 10.7,-5.25; 81 10.7,-4.75; 82 10.7,-4.25; 83 10.7,-3.75; 84 10.7,-3.25; 85 10.7,-2.75; 86 10.7,-2.25; 87 10.7,-1.75; 88 10.7,-1.25; 89 10.7,-0.75; 90 10.7,-0.25; 91 10.7,0.25; 92 10.7,0.75; 93 10.7,1.25; 94 10.7,1.75; 95 10.7,2.25; 96 10.7,2.75; 97 10.7,3.25; 98 10.7,3.75; 99 10.7,4.25; 100 10.7,4.75; 101 10.7,5.25; 102 10.7,5.75; 103 10.7,6.25; 104 10.7,6.75; 105 10.7,7.25; 106 10.7,7.75; 107 10.7,8.25; 108 10.7,8.75 | smd 0.35 x 1.6: 37 -8.75,-10.7; 38 -8.25,-10.7; 39 -7.75,-10.7; 40 -7.25,-10.7; 41 -6.75,-10.7; 42 -6.25,-10.7; 43 -5.75,-10.7; 44 -5.25,-10.7; 45 -4.75,-10.7; 46 -4.25,-10.7; 47 -3.75,-10.7; 48 -3.25,-10.7; 49 -2.75,-10.7; 50 -2.25,-10.7; 51 -1.75,-10.7; 52 -1.25,-10.7; 53 -0.75,-10.7; 54 -0.25,-10.7; 55 0.25,-10.7; 56 0.75,-10.7; 57 1.25,-10.7; 58 1.75,-10.7; 59 2.25,-10.7; 60 2.75,-10.7; 61 3.25,-10.7; 62 3.75,-10.7; 63 4.25,-10.7; 64 4.75,-10.7; 65 5.25,-10.7; 66 5.75,-10.7; 67 6.25,-10.7; 68 6.75,-10.7; 69 7.25,-10.7; 70 7.75,-10.7; 71 8.25,-10.7; 72 8.75,-10.7; 109 8.75,10.7; 110 8.25,10.7; 111 7.75,10.7; 112 7.25,10.7; 113 6.75,10.7; 114 6.25,10.7; 115 5.75,10.7; 116 5.25,10.7; 117 4.75,10.7; 118 4.25,10.7; 119 3.75,10.7; 120 3.25,10.7; 121 2.75,10.7; 122 2.25,10.7; 123 1.75,10.7; 124 1.25,10.7; 125 0.75,10.7; 126 0.25,10.7; 127 -0.25,10.7; 128 -0.75,10.7; 129 -1.25,10.7; 130 -1.75,10.7; 131 -2.25,10.7; 132 -2.75,10.7; 133 -3.25,10.7; 134 -3.75,10.7; 135 -4.25,10.7; 136 -4.75,10.7; 137 -5.25,10.7; 138 -5.75,10.7; 139 -6.25,10.7; 140 -6.75,10.7; 141 -7.25,10.7; 142 -7.75,10.7; 143 -8.25,10.7; 144 -8.75,10.7
VDFN10 = smd 0.8 x 0.3: 1 -1.5,1; 2 -1.5,0.5; 3 -1.5,0; 4 -1.5,-0.5; 5 -1.5,-1; 6 1.5,-1; 7 1.5,-0.5; 8 1.5,0; 9 1.5,0.5; 10 1.5,1 | drill 0.3 pad 0.61: P$1 -0.5,0.5; P$2 0.5,0.5; P$3 0.5,-0.5; P$4 -0.5,-0.5
QFN32 = smd 0.75 x 0.3: 1 -2.525,1.75; 2 -2.525,1.25; 3 -2.525,0.75; 4 -2.525,0.25; 5 -2.525,-0.25; 6 -2.525,-0.75; 7 -2.525,-1.25; 8 -2.525,-1.75; 17 2.525,-1.75; 18 2.525,-1.25; 19 2.525,-0.75; 20 2.525,-0.25; 21 2.525,0.25; 22 2.525,0.75; 23 2.525,1.25; 24 2.525,1.75 | smd 0.3 x 0.75: 9 -1.75,-2.525; 10 -1.25,-2.525; 11 -0.75,-2.525; 12 -0.25,-2.525; 13 0.25,-2.525; 14 0.75,-2.525; 15 1.25,-2.525; 16 1.75,-2.525; 25 1.75,2.525; 26 1.25,2.525; 27 0.75,2.525; 28 0.25,2.525; 29 -0.25,2.525; 30 -0.75,2.525; 31 -1.25,2.525; 32 -1.75,2.525 | smd 3.2 x 3.2: 33 0,0 | drill 0.3 pad 0.406: P$1 0,1; P$2 1,1; P$3 1,0; P$4 0,0; P$5 -1,1; P$6 -1,0; P$7 -1,-1; P$8 0,-1; P$9 1,-1
DFN8 = smd 0.25 x 0.68: 1 -0.75,-1.39; 2 -0.25,-1.39; 3 0.25,-1.39; 4 0.75,-1.39; 5 0.75,1.39; 6 0.25,1.39; 7 -0.25,1.39; 8 -0.75,1.39 | smd 2.4 x 1.7: 9 0,0
3.2X2.5_OSC = smd 1.6 x 1.4: 1 -1.25,0.875; 2 -1.25,-0.875; 3 1.25,-0.875; 4 1.25,0.875

### Placement (x,y rotation side)
C1  9.5,28.25 270 top
C2  17.36,11.25 0 top
C3  19.5,42.25 0 top
C4  23.25,11 180 top
C5  7.25,28.25 270 top
C6  17.36,13.46 0 top
C7  19.5,44.5 0 top
C8  21.25,11.5 90 top
C9  5,28.25 270 top
C10  27.75,48 0 top
C11  19.5,46.75 0 top
C12  20.5,8.75 180 top
C13  2.75,28.25 270 top
C14  27.75,45.75 0 top
C15  43.25,27.5 90 top
C16  7.25,25 270 top
C17  27.75,43.5 0 top
C18  41,27.5 90 top
C19  5,25 270 top
C20  27.75,41.25 0 top
C21  38.75,27.5 90 top
C22  2.75,25 270 top
C23  43.25,24.75 270 top
C24  41,24.75 270 top
C25  78.75,21 180 top
C26  78.75,25.5 180 top
C27  78.75,27.75 180 top
C28  74.15,16.95 270 top
C29  63.5,35.5 0 top
C30  67.8,26.3 180 top
C31  70.25,35.5 180 top
J1  57.5,17 90 top
J2  64.25,48.5 180 top
J3  16.25,49.75 180 top
J4  23,49.75 180 top
J5  4.5,36.75 270 top
J6  4.5,16.9 90 top
J7  38.5,44.25 270 top
J8  79.75,13.5 90 top
L1  78.75,23.25 180 top
L2  62.25,29.75 270 top
L3  71.25,29.75 90 top
LED0  68,45.25 90 top
LED1  70.25,45.25 90 top
LED2  72.5,45.25 90 top
LED3  74.75,45.25 90 top
LED4  10,45 90 top
LED5  12.25,45 90 top
LED6  14.5,45 90 top
LED7  16.75,45 90 top
PWR  69.75,12.25 90 top
R1  54.6,35 135 top
R2  53.5,19.75 315 bottom
R3  68,42.25 90 top
R4  70.25,42.25 90 top
R5  72.5,42.25 90 top
R6  74.75,42.25 90 top
R7  52,18.75 90 top
R8  10,42.25 90 top
R9  12.25,42.25 90 top
R10  14.5,42.25 90 top
R11  16.75,42.25 90 top
R12  34.25,16.5 270 top
R13  36.5,16.5 270 top
R14  17.5,8.75 270 top
R15  15.25,9.5 0 top
R16  73.75,36.5 270 top
R17  30.5,48.75 0 top
R18  78.75,30 180 top
R19  30.5,51 0 top
R20  73.5,33.5 270 top
R21  30.75,42.25 0 top
R22  47.5,18.75 270 top
R23  44.5,22 180 top
R24  48.5,10.5 180 bottom
R25  54,14 180 bottom
R26  65.25,15.75 270 top
R27  67.5,15.75 270 top
R28  63.25,33.1 0 top
R29  65.5,31.6 0 top
R30  67.5,33.1 0 top
R31  70.25,33.1 0 top
R32  69.75,15.75 270 top
RX  67.5,12.25 90 top
S1  57.5,9.25 180 top
S2  21.75,4.5 180 top
S3  37.5,9.75 0 top
TX  65.25,12.25 90 top
U1  47.06,26.59 0 bottom
U2  57.78,22.15 90 bottom
U3  50.75,44.5 0 top
U4  23.56,28.48 0 top
U5  29.63,11.41 180 top
U6  77,33.5 270 top
U7  32.5,45.5 270 top
U8  40.75,18 180 top
U9  71.25,21 0 top
U10  66.5,29.25 270 top
X1  49.25,14 0 bottom
X2  22.75,15 180 top
X3  40.25,32.75 270 top

### Tracks (layer width: path | path; a pad name or v marks a point on that pad's centre or on a via)
1V2  (via drill 0.3, 0.35)
  Top 0.305: 31.75,51 R19.2 v32.75,51 33.5,50.25 U7.1
  PowerPlane 0.305: v32.75,51 33.75,52 69.25,52 71.5,49.75 v71.5,34.5
  other vias: 71.5,32.75 71.5,31.25
  pour Top (isolate 0.406, no thermals): 70.5,30.25 72,30.25 72,36.25 70.75,36.25 70.75,32.25 70.5,32
3V3  (via drill 0.2, 0.3)
  Top 0.254: U10.7 69.5,29.5 v69.5,30 | U7.10 33.5,43.5 v34.25,42.75
  Top 0.305: v77,37 U6.3 | R17.2 v32.25,48.75 32.5,48.5 U7.3 | R16.2 72.3,37 64.05,37 C29.1 | v48.75,17.25 R22.2 47.3,18 U8.3 | U6.10 78.5,32 79,32.5 v79,34.25 | J1.2 57.71,11.75 v60.25,11.75 | U8.10 39,16.75 v39,16.25
  other vias: 62.25,34.5 62.25,32.75 62.25,31.25
  pour Top (isolate 0.406, no thermals): 61.5,30.25 63,30.25 63,36.25 62,36.25 61.5,34.25
  pour PowerPlane (isolate 0.406, hatched): 81.75,51.75 81.75,0.75 0.5,0.75 0.5,51.75
5V  (via drill 0.2, 0.35)
  Top 0.305: U9.19 74.5,20.25 v75.12,20.88 75.22,20.97 75.22,22.85 73.78,24.29 | C30.1 71.77,26.3 73.78,24.29 | 73.78,24.29 73.78,25.98 R18.2 | U9.1 68,22.75 67,23.75 v67,24.25 | RX.1 PWR.1 73.8,11.3 v75,12.5 | U10.2 v64,29.5 64.5,29 U10.3 | U6.2 77.5,35.62 78.38,36.5 79.75,36.5 80.75,35.5 v80.75,29.5
  Top 0.406: TX.1 RX.1
  PowerPlane 0.305: v75,12.5 75,20.75 v75.12,20.88 | v64,29.5 65.75,27.75 v68.5,27.75 | v67,24.25 68.75,26 C30.1 69.95,27.5 78.75,27.5 v80.75,29.5
  other vias: 68.75,26.3
  pour Top (no thermals): 67.6,28.6 68.5,28.6 69.25,27.75 69.25,25.65 68.25,25.65 68.25,27.25
A8  (via drill 0.2)
  Top 0.254: v38.25,22 38.23,21.98 37,21.98 36.75,22.23 U4.78
  Bottom 0.125: U1.35 41.09,23.84 39.25,22 v38.25,22
A9  (via drill 0.2)
  Top 0.254: U4.79 37,22.73 37.23,22.5 v38.75,22.5
  Bottom 0.125: U1.36 41.09,24.34 39.25,22.5 v38.75,22.5
A10  (via drill 0.2)
  Top 0.254: U4.80 37.5,23.23 37.73,23 v38.25,23
  Bottom 0.125: U1.37 41,24.84 39.16,23 v38.25,23
A11  (via drill 0.2)
  Top 0.254: U4.81 37.75,23.73 37.98,23.5 v38.75,23.5
  Bottom 0.125: U1.38 41.01,25.34 39.17,23.5 v38.75,23.5
A12  (via drill 0.2)
  Top 0.254: v38.25,24 38.02,24.23 U4.82
  Bottom 0.125: U1.39 40.84,25.84 39,24 v38.25,24
A13  (via drill 0.2)
  Top 0.254: v38.75,24.5 38.52,24.73 U4.83
  Bottom 0.125: v38.75,24.5 40.59,26.34 U1.40
A14  (via drill 0.2)
  Top 0.254: v38.75,25.25 38.73,25.23 U4.84
  Bottom 0.125: v38.75,25.25 40.34,26.84 40.5,26.84
  Bottom 0.127: 40.5,26.84 U1.41
A15  (via drill 0.2)
  Top 0.254: v38.25,25.75 38.23,25.73 U4.85
  Bottom 0.125: v38.25,25.75 39.84,27.34 40,27.34 | 40,27.34 40.25,27.34 | 40,27.34 U1.42
AD0  (via drill 0.2)
  Top 0.254: U4.105 37.23,35.73 v37.75,36.25
  Bottom 0.125: U1.51 44.31,31.69 40.25,35.75
  Bottom 0.127: v37.75,36.25 39.75,36.25 40.25,35.75
AD1  (via drill 0.2)
  Top 0.254: U4.104 37.48,35.23 v37.75,35.5
  Bottom 0.125: U1.50 43.81,31.69 40.25,35.25 38,35.25 v37.75,35.5
AD2  (via drill 0.2)
  Top 0.254: U4.102 37.23,34.23 v37.75,34.75
  Bottom 0.125: U1.49 43.31,31.69 40.75,34.25
  Bottom 0.127: v37.75,34.75 40.25,34.75 40.75,34.25
AD3  (via drill 0.2)
  Top 0.254: U4.101 37.48,33.73 v37.75,34
  Bottom 0.127: v37.75,34 41.41,30.34 U1.48
AD4  (via drill 0.2)
  Top 0.254: U4.100 37.73,33.23 v37.75,33.25
  Bottom 0.127: v37.75,33.25 41.16,29.84 U1.47
AD5  (via drill 0.2)
  Top 0.254: U4.99 37.52,32.73 v37.75,32.5
  Bottom 0.125: 42,29.34 U1.46
  Bottom 0.127: v37.75,32.5 40.91,29.34 42,29.34
AD6  (via drill 0.2)
  Top 0.254: U4.98 37.27,32.23 v37.75,31.75
  Bottom 0.127: v37.75,31.75 40.66,28.84 U1.45
AD7  (via drill 0.2)
  Top 0.254: U4.97 37.02,31.73 v37.75,31
  Bottom 0.127: v37.75,31 40.41,28.34 U1.44
ALE  (via drill 0.2)
  Top 0.254: U4.95 37.27,30.73 v37.75,30.25
  Bottom 0.127: v37.75,30.25 40.16,27.84 U1.43
CCLK  (via drill 0.2)
  Top 0.125: U5.6 27.95,12.04 30,10 33,10 34,11 34,13.75 v31.75,16 31.31,16.44 U4.70 | v41.75,15.5 47.75,15.5 v49.75,17.5
  Bottom 0.125: v41.75,15.5 41,14.75 33.5,14.75 32.25,16 v31.75,16 | U1.19 49.81,17.56 v49.75,17.5
CSI_B/FPGA_MISO0  (via drill 0.2)
  Top 0.125: U5.5 27.32,13.31 28.31,14.31 v28.31,16.5 U4.64 | v42.25,15 48.25,15 v50.25,17
  Bottom 0.125: v28.31,16.5 30.31,14.5 41.75,14.5 v42.25,15 | U1.18 50.25,22.03 v50.25,17
CSO_B
  Top 0.125: U4.38 15.31,8.69 16.2,7.8 R14.2 18.3,7 29.57,7 U5.1
FPGA_GPIO_0
  Top 0.125: J5.10 10.37,37.23 U4.1
FPGA_GPIO_1
  Top 0.125: U4.2 10.25,36.73 6.73,40.25 4.81,40.25 J5.1
FPGA_GPIO_2
  Top 0.125: J5.9 9.83,35.23 U4.5
FPGA_GPIO_3
  Top 0.125: U4.6 9.75,34.73 6.73,37.75 4.77,37.75 J5.2
FPGA_GPIO_4
  Top 0.125: J5.8 8.29,34.23 U4.7
FPGA_GPIO_5
  Top 0.125: U4.8 8,33.73 6.48,35.25 4.73,35.25 J5.3
FPGA_GPIO_6
  Top 0.125: J5.7 6.75,33.23 U4.9
FPGA_GPIO_7
  Top 0.125: J5.4 4.71,32.73 U4.10
FPGA_GPIO_8
  Top 0.125: J5.6 6.33,32.23 U4.11
FPGA_GPIO_9
  Top 0.125: U4.12 7.75,31.73 6.52,30.5 4.4,30.5 J5.5
FPGA_GPIO_10
  Top 0.125: 11.98,25.73 U4.24 11.5,25.73 7.75,21.98 J6.5
FPGA_GPIO_11
  Top 0.125: 12.01,26.23 U4.23 11.5,26.23 8.27,23 4.25,23 J6.6
FPGA_GPIO_12
  Top 0.125: U4.27 10.98,24.23 6.19,19.44 J6.4
FPGA_GPIO_13
  Top 0.125: 11.53,24.73 U4.26 11,24.73 7.02,20.75 4.54,20.75 J6.7
FPGA_GPIO_14
  Top 0.125: U4.30 11.75,22.73 5.92,16.9 J6.3
FPGA_GPIO_15
  Top 0.125: U4.29 11.75,23.23 6.77,18.25 5.75,18.25 4.58,18.25 J6.8
FPGA_GPIO_16
  Top 0.125: U4.33 11.98,21.23 8.5,17.75 8.5,15.5 7.36,14.36 J6.2
FPGA_GPIO_17
  Top 0.125: J6.9 4.18,15.31 7.82,15.31 8.25,15.75 8.25,18 11.98,21.73 U4.32
FPGA_GPIO_18
  Top 0.125: U4.35 11.98,20.23 9,17.25 9,15.05 J6.1
FPGA_GPIO_19
  Top 0.125: J6.10 4.41,13 6.5,13 8.75,15.25 8.75,17.5 11.98,20.73 U4.34
FPGA_LED0
  Top 0.125: U4.144 14.81,39.86 14.21,40.46 10.84,40.46 R8.1
FPGA_LED1
  Top 0.125: U4.143 15.25,39.24 15.25,40 14.5,40.75 12.8,40.75 R9.1
FPGA_LED2
  Top 0.125: U4.142 15.81,39.99 R10.1
FPGA_LED3
  Top 0.125: R11.1 16.31,40.86 U4.141
FPGA_RESET
  Top 0.125: U4.37 14.81,10.01 R15.1 14.3,5.69 15.51,4.48 S2.2
FPGA_VCCAUX  (via drill 0.2)
  Top 0.305: C22.1 C19.1 | U4.20 11.5,27.73 8.77,25 7.75,25 7.25,25.5 C16.1 | 12.88,19.75 U4.36 17.31,19.73 17.31,19.69 | U4.18 13.77,28.73 | 17.31,19.69 U4.42 17.31,15.75 16.41,14.85 16.41,14.59 | 17.31,19.69 14.75,22.25 14.75,22.23 U4.31 11.75,22.23 7.5,17.98 7.5,17.07 6.36,15.93 6.25,15.75 2.25,15.75 1.12,16.88 1.12,26.88 | U4.63 27.81,19.06 29.98,21.23 | 29.98,21.23 U4.76 36.5,21.23 36.77,21.38 38.75,21.38 39.31,20.82 39.31,20 36.76,17.45 R13.1 R12.1 | 29.98,21.23 31.5,22.75 31.5,24.75 32.98,26.23 U4.86 36.25,26.23 36.6,26.59 37.25,26.59 | 31.75,29.25 32.77,28.23 U4.90 36.48,28.23 | 31.75,29.25 31.75,33.75 32.73,34.73 U4.103 | C17.1 26.8,42.75 25.81,41.76 | 26.8,45.73 C17.1 | 26.8,45.73 C14.1 | C17.1 | C14.1 C10.1 v26,48 | C11.1 C7.1 | 18.55,42.14 C3.1 19,42.7 C7.1 | 18.55,42.14 18.55,41.45 19.31,40.69 U4.135 19.31,37.94 20.25,37 | U4.129 22.31,37.81 21.5,37 20.25,37 | 17.98,35.73 U4.4 | 20.25,37 19.25,37 17.98,35.73 | U4.18 14,28.73 16,30.73 16,33.75 17.98,35.73 | C2.1 16.41,9.71 R15.2 16.7,10 17.2,10 | C2.1 C6.1 16.41,14.59 | 16.41,10.84 C2.1 | U4.18 12.84,28.75 11.75,28.75 10.5,30 1.75,30 1.12,29.38 1.12,26.88 | C21.1 38.51,26.59 37.25,26.59 | C18.1 38.83,27 C21.1 | C18.1 C24.1 C23.1 | 36.48,28.23 37.5,29.25 39.75,29.25 41.12,30.62 X3.4 X3.1 | 36.48,28.23 37.25,27.46 37.25,26.59 | 25.81,41.76 24.31,40.26 U4.125 24.31,36.69 31.75,29.25 | U4.122 25.81,41.76 | 29.98,21.23 25.23,21.23 22.81,18.81 U4.53 22.81,14.12 | U7.2 33,49.5 32.75,49.75 30.8,49.75 R19.1 26.5,51 25.25,49.75 17.52,49.75 J3.1 17.77,48.48 19,47.25 C11.1 | 17.8,10 17.2,10 | U5.8 26.43,9.5 23,9.5 22.3,10.2 C4.2 | C20.1 C17.1 | C20.1 | X2.4 22.81,14.12
  Top 0.305: 22.81,14.12 X2.1 | C4.2 22.81,11.51 22.81,14.12 | 17.8,10 R14.1 17.2,10 | C22.1 2.5,25.5 1.12,26.88 | C15.1 42.8,27 C18.1 | v8.5,26 7.3,26 C16.1 | C16.1 6.45,25.95 6,25.5 C19.1 | v5,26 C19.1 | v2.75,26 C22.1 | v16.5,12.25 16.41,12.16 C2.1 | v16.5,14.5 16.41,14.59 | C8.1 20.25,10 17.8,10 | C12.1 21.25,9 v21.25,10.5 C8.1 | C8.1 C4.2 | v22.25,10 22.3,10.05 C4.2 | v38.25,27 C21.1 | v17.75,42.5 18.55,42.5 18.55,42.14 | v18.25,44.5 C7.1 | v18.25,46.75 C11.1 | v26,41.25 C20.1 | C20.1 | v26,43.5 C17.1 | C17.1 | v26,45.75 C14.1 | C14.1 26.8,45.73
  PowerPlane 0.305: v8.5,26 v5,26 v2.75,26
FPGA_VCCINT  (via drill 0.2)
  Top 0.305: 6.04,29.2 C5.1 8.29,29.2 | 6.04,29.2 C9.1 3.2,29.2 C13.1 2.75,29 v2.25,29.25 | 16,25 16,26.5 14.27,28.23 U4.19 10.47,28.23 C1.1 | U4.28 14.73,23.73 16,25 | U4.52 22.31,19.06 24.25,21 | 16,25 16,23 18,21 24.25,21 | C1.1 8.29,29.2 | 24.25,21 30.98,27.73 U4.89 32.08,27.73 22.81,37 U4.128 22.81,43.06 23.5,43.75 23.5,47.98 J4.1 24.75,48.48 25.52,49.25 29.5,49.25 29.55,49.2 R17.1 30.8,47.75 32,47.75 U7.4 | v6,29.25 v6,29.24 6.04,29.2 | v8.25,29.25 v8.25,29.24 8.29,29.2 | v10.5,29.25 9.55,29.25 C1.1
FTDI_RXLED
  Top 0.125: R27.1 68.05,17.25 70,17.25 70.5,17.75 U9.11
GND  (via drill 0.2, 0.25)
  Top 0.305: U4.54 23.31,16.57 X2.2 | v72.25,24.75 72.5,24.5 U9.26 72.5,22.25 | 72.5,22.25 U9.P$4 | 72.5,22.25 73,22.75 U9.24 | 24.75,20 v25.25,20 | U4.68 30.31,16.31 v30.25,16.25 | U9.4 70,21.25 U9.P$6 | U9.20 72.5,20.75 U9.P$3 | U9.17 73,19.25 U9.P$9 | v8.25,24 7.3,24 C16.2 | v6,27.25 5.05,27.25 C9.2 | v8.25,27.25 7.3,27.25 C5.2 | C1.2 10.3,27.3 v10.5,27.5 | 18.96,13.46 C6.2 18.31,12.69 v18.5,12.5 | 21.75,12 C8.2 21,12 20.25,11.25 v19,11.25 | v25,11 C4.1 | v43.5,30 43.25,29.75 C15.2 | v38.25,28 C21.2 | C20.2 v29.5,41.25 | C17.2 v29.5,43.5 | v29.5,45.75 C14.2 | v29.5,47.75 28.7,47.75 C10.2 | v20.75,46.75 C11.2 | v20.75,44.5 C7.2 | v21.25,42.25 C3.2 | v80.5,25.5 C26.1 | v80.5,27.75 C27.1
  other vias: 54.5,19.25 64.25,27 46.5,35.25 50,32.5 19.75,19.75 31.5,20.25 32.5,23.5 29.25,23.5 22,27.5 24,27.5 24,25.5 22,25.5 20,25.5 20,27.5 20,29.5 22,29.5 24,29.5 17.5,8.75 25.75,16.5 25,44 22,44.75 16,37.25 14.75,33.25 1.75,28.75 14.5,26 2,20.75 31,15 36,29.25 74.25,15 25.75,15.25 47,46.75 45.75,44.25 45.5,41.75 45.5,39.25 73.75,30.5 59,22.5 14.75,20.75 40.25,32.75 57.5,17 68.5,24.25 11.25,23.5 7.5,16 10.75,31 2.75,24 5,24 2.75,27.25 77,21
  pour Top (rank 2, hatched): 0.5,51.5 82,51.5 82,0.5 0.5,0.5
  pour Bottom (hatched): 0.5,51.5 81.5,51.5 81.5,1 0.5,1
  pour GroundPlane (isolate 0.406, hatched): 0.75,52 81.75,52 81.75,1 0.5,0.5
INIT_B  (via drill 0.2)
  Top 0.125: U4.39 15.81,16.69 v16.25,16.25 | v42.75,14.5 48.81,14.5 v50.81,16.5
  Bottom 0.125: v16.25,16.25 16.5,16 28.25,16 30,14.25 42.5,14.25 v42.75,14.5 | U1.17 v50.81,16.5
JTAG_TCK
  Top 0.254: J7.P$3 32.31,39.33 U4.109
  Bottom 0.125: U1.57 47.31,32.94 40.25,40 40.25,43.77 J7.P$3
JTAG_TDI
  Top 0.254: U4.110 31.81,38.25 32.03,38.03 33.03,38.03 35.44,40.44 J7.P$5
  Bottom 0.125: 46.31,31.44 U1.55 46.31,32.94 38.81,40.44 J7.P$5 37.31,40.44
JTAG_TDO
  Top 0.125: 37.5,36.75 39,36.75 39.75,37.5 39.75,41.73 J7.P$4
  Top 0.254: 37.5,36.75 36.98,36.23 36.5,36.23 U4.106
  Bottom 0.125: U1.56 46.81,32.92 46.75,33 40,39.75 40,41.48 J7.P$4
JTAG_TMS
  Top 0.125: U4.107 36,36.73 37.17,37.9 J7.P$6
  Bottom 0.125: 45.81,31.69 U1.54 45.81,32.94 40.85,37.9 J7.P$6
MCU_FLASH_CE
  Bottom 0.125: U2.1 59.25,19.27 59.25,18.25 53.66,18.25 R2.2 52.25,19.66 52.25,21 53,21.75 53,23.25 52.41,23.84 U1.14
MCU_GPIO_0
  Bottom 0.125: U1.58 47.81,33.06 57,42.25 62.11,42.25 62.98,43.12 J2.4
MCU_GPIO_1
  Bottom 0.125: U1.59 48.31,33 57.32,42 62.25,42 64.12,43.88 64.12,48.6 J2.3
MCU_GPIO_2
  Bottom 0.125: U1.60 48.81,33 57.56,41.75 62.5,41.75 64.38,43.62 64.38,48.6 J2.2
MCU_GPIO_3
  Bottom 0.125: U1.61 49.31,33.06 57.75,41.5 62.75,41.5 65.52,44.27 J2.1
MCU_LED0  (via drill 0.2)
  Top 0.125: v68,40.5 R3.1
  PowerPlane 0.125: v54.75,31.25 50,26.5 v50,23
  Bottom 0.125: v50,23 50.16,22.84 U1.16 | v54.75,31.25 55,31.25 63.25,39.5 67,39.5 v68,40.5
MCU_LED1  (via drill 0.2)
  Top 0.125: v68.5,40 69.75,40 70.25,40.5 R4.1
  PowerPlane 0.125: v50.5,23.75 50.5,26.25 v54.75,30.5
  Bottom 0.125: v50.5,23.75 50.91,23.34 U1.15 | v54.75,30.5 63.5,39.25 67.75,39.25 v68.5,40
MCU_LED2  (via drill 0.2)
  Top 0.125: v69,39.5 71.75,39.5 72.5,40.25 R5.1
  PowerPlane 0.125: v56.75,28.84 v56.75,31.25
  Bottom 0.125: U1.4 v56.75,28.84 | v56.75,31.25 56.75,32 63.75,39 68.5,39 v69,39.5
MCU_LED3  (via drill 0.2)
  Top 0.125: v69.5,39 73.75,39 74.75,40 R6.1
  PowerPlane 0.125: v57.5,28.34 v57.5,30.5
  Bottom 0.125: U1.5 v57.5,28.34 | v57.5,30.5 57.5,32.25 64,38.75 69.25,38.75 v69.5,39
MCU_MISO  (via drill 0.2)
  Top 0.125: U3.7 57.4,38.15 52.75,33.5 52.75,30 54.5,28.25 55.75,28.25 56,28 56,24.25 55.25,23.5 v54.25,23.5
  Bottom 0.125: U2.2 58.41,21.09 57.25,22.25 54.5,22.25 53.25,23.5 | U1.13 52.41,24.34 53.25,23.5 | v54.25,23.5 53.25,23.5
MCU_MOSI  (via drill 0.2)
  Top 0.125: U3.5 45.56,40.69 51.5,34.75 51.5,28.25 55,24.75 v55,24.29
  Bottom 0.125: U1.12 53,24.84 53.55,24.29 v55,24.29 55.56,24.29 U2.5
MCU_RESET  (via drill 0.2)
  Top 0.125: J1.5 59.54,19.54 58.25,18.25 52.45,18.25 R7.1 | S1.2 52.5,9.66 52.5,17.3 R7.1 | v49.31,19.05 50.75,19.05 R7.1
  Bottom 0.125: U1.20 v49.31,19.05
MCU_RX0/PDI  (via drill 0.2)
  Top 0.125: U9.30 70.5,24.25 70,24.75 v63.75,24.75 62.5,23.5 62.5,16.5 61.75,15.75 56.25,15.75 J1.4
  Bottom 0.125: U1.2 57.16,29.84 62.25,24.75 v63.75,24.75
MCU_SCK  (via drill 0.2)
  Top 0.125: J1.3 61,17 62,18 62,20.88 v56.88,26 | U3.6 45.5,38.15 51.25,32.4 51.25,27.84 v54.25,24.84
  Bottom 0.125: U2.6 57.15,25.73 v56.88,26 55.41,26 v54.25,24.84 53.75,24.84 53.25,25.34 U1.11
MCU_TX0/PDO  (via drill 0.2)
  Top 0.125: J1.1 60.29,14.25 61.75,14.25 62.75,15.25 62.75,22.75 v64.25,24.25 66,24.25 68,22.25 U9.2
  Bottom 0.125: U1.3 57.21,29.34 62.3,24.25 v64.25,24.25
MCU_VCC  (via drill 0.2, 0.3)
  Top 0.305: 51.2,20.5 v48.81,20.5 48.3,20.5 R22.1 46.3,18.5 U8.4 | 51.2,20.5 R7.2 | 51.2,20.5 52.75,20.5 v53.75,21.5 v55,22.75 | R1.1 59,30.6 v59,26
  Bottom 0.305: U1.52 44.81,30.44 45.25,30 | 49.25,30 45.25,30 | 49.25,30 50.25,30 50.81,30.56 U1.64 | U1.62 49.81,30.56 49.25,30 | 45.25,30 44.25,30 43.75,29.5 43.75,23.75 44.25,23.25 48.25,23.25 48.81,22.69 U1.21 v48.81,20.5 | U2.3 57.15,20.86 56.5,21.5 v53.75,21.5 53.75,20.84 R2.1 | U2.7 U2.8 | U2.7 58.41,23.41 58,23 55.25,23 v55,22.75 | v59,26 58.41,25.41 U2.7
MODE0
  Top 0.125: U4.69 30.81,18.56 31.25,19 32.5,19 33,18.5 33,16.75 34,15.75 R12.2 34.86,15.55 S3.1
MODE1  (via drill 0.2)
  Top 0.125: U4.60 26.31,18.56 v26.75,19 | v30.5,19.25 32.75,19.25 33.25,18.75 33.25,17 34,16.25 35,16.25 35.7,15.55 R13.2 37.4,15.55 S3.2
  Bottom 0.125: v30.5,19.25 30.25,19 v26.75,19
N$1
  pour Top (no thermals): 65.5,28.75 65.5,28.25 61.75,28.25 61.5,28.5 61.5,29.25 63,29.25 63.5,28.75
N$2
  Top 0.305: U10.1 64.55,30.56 R29.1 64.55,32.75 R28.2
N$3
  Top 0.125: C28.1 73.47,18.48 U9.16
N$7
  Top 0.406: U10.8 68.45,30.56 R30.2 R31.1
N$8
  Top 0.254: U10.6 71.25,29 L3.1
  pour Top (no thermals): 69,29 71.75,29 71.75,28.5 70.75,28.5
N$10
  Top 0.125: R26.1 66.05,17.5 69.75,17.5 70,17.75 U9.10
N$11
  Top 0.305: R26.2 TX.2
N$13
  Top 0.125: LED3.1 R6.2
N$14
  Top 0.125: R27.2 RX.2
N$15
  Top 0.125: LED2.1 R5.2
N$16
  Top 0.125: R23.2 42.25,22 U8.6
N$23
  Top 0.125: R4.2 LED1.1
N$24
  Top 0.125: LED0.1 R3.2
N$25
  Top 0.125: LED7.1 R11.2
N$27
  Top 0.125: LED6.1 R10.2
N$28
  Top 0.125: R21.2 31.7,43 31.5,43.2 U7.6
N$29
  Top 0.125: R9.2 LED5.1
N$30
  Top 0.125: LED4.1 R8.2
N$32
  Top 0.125: R20.2 74.05,32 U6.6
N$38
  Bottom 0.125: U1.23 47.81,16.94 49.25,15.5 49.25,13.5 49.62,13.12 X1.2
N$39
  Bottom 0.125: U1.24 47.31,15.56 X1.4
N$41
  Top 0.305: R32.2 PWR.2
OSC_32
  Top 0.254: U4.94 37.02,30.23 37.5,29.75 38.5,29.75 39.38,30.62 X3.3
OSC_50
  Top 0.305: U4.51 21.81,16.18 X2.3
RD  (via drill 0.2)
  Top 0.254: U4.75 38.23,20.73 v38.25,20.75
  Bottom 0.125: U1.34 41.34,23.34 38.75,20.75 v38.25,20.75
SELECTMAP_D0/FPGA_MISO1  (via drill 0.2)
  Top 0.125: U4.65 v28.81,14.74 29.57,15.5 31.75,15.5 33.75,13.5 33.75,11.25 33.27,10.78 U5.2
  Bottom 0.125: 43.25,14.25 43,14 29.55,14 v28.81,14.74
  Bottom 0.127: 43.25,14.25 43.31,14.31 U1.32
SELECTMAP_D1/FPGA_MISO2  (via drill 0.2)
  Top 0.125: U4.62 v27.31,14.5 27.06,14.25 25.65,14.25 25.25,13.8 25.25,13.03 25.5,12.72 28.32,12.72 29,12.04 U5.3
  Bottom 0.125: U1.31 43.81,14.31 43.25,13.75 28.06,13.75 v27.31,14.5
SELECTMAP_D2/FPGA_MISO3  (via drill 0.2)
  Top 0.125: U5.7 26.41,10.76 25.99,10.76 25,11.75 25,14 25.5,14.5 26.35,14.5 v26.81,14.96 U4.61
  Bottom 0.125: U1.30 44.31,14.31 43.5,13.5 27.5,13.5 26.81,14.19 v26.81,14.96
SELECTMAP_D3  (via drill 0.2)
  Top 0.125: U4.46 v19.31,15.5
  Bottom 0.125: U1.29 44.81,14.31 43.75,13.25 20.5,13.25 19.31,14.44 v19.31,15.5
SELECTMAP_D4/MCU_TX1  (via drill 0.2)
  Top 0.125: U4.45 v18.81,15
  Bottom 0.125: U1.28 45.31,14.31 44,13 20.25,13 18.81,14.44 v18.81,15
SELECTMAP_D5/MCU_RX1  (via drill 0.2)
  Top 0.125: U4.44 v18.31,15.5
  Bottom 0.125: U1.27 45.81,18.75 45.81,14.31 44.25,12.75 20,12.75 18.31,14.44 v18.31,15.5
SELECTMAP_D6/SDA  (via drill 0.2)
  Top 0.125: U4.43 v17.81,15 | 38.75,18 38,17.25 38,16 38.5,15.5 39.75,15.5 44.25,11 45,11 46,12 v46.5,12 45.75,12 v45.25,12.5
  Top 0.127: U8.8 38.75,18
  Top 0.152: v77,31.25 U6.8 | v32.5,42.25 U7.8
  Bottom 0.125: 44.5,12.5 19.75,12.5 17.81,14.44 v17.81,15 | U1.26 46.31,14.31 44.5,12.5 | 44.5,12.5 v45.25,12.5 | 32.75,42.25 35,44.5 35,49.75 37,51.75 76,51.75 79.5,48.25 79.5,33.75 v77,31.25 | R25.1 53.05,12.86 52.19,12 v46.5,12
  Bottom 0.152: v77,31.25 57.75,12 52.19,12 | 32.75,42.25 v32.5,42.25
SELECTMAP_D7/SCL  (via drill 0.2)
  Top 0.125: U6.9 77.5,31.5 v78,31 | 38.75,17.5 38.25,17 38.25,16.25 38.75,15.75 40,15.75 44.25,11.5 v44.5,11.5 | v20.06,12 20.31,12.25 U4.48
  Top 0.127: U8.9 38.75,17.5
  Top 0.152: v33,43.25 U7.9
  Bottom 0.125: v44.5,11.5 43.75,12.25 20.31,12.25 v20.06,12 | U1.25 46.81,14.31 46,13.5 | 33,43.5 34.5,45 34.5,49.75 36.75,52 76.25,52 79.75,48.5 79.75,33.25 78,31.5 | 78,31.5 76.75,30.25 | v78,31 78,31.5
  Bottom 0.127: v44.5,11.5 45.5,10.5 R24.1
  Bottom 0.152: 46,13.5 46,12.25 45.25,11.5 v44.5,11.5 58,11.5 76.75,30.25 | 33,43.5 v33,43.25
USB_VCC  (via drill 0.25)
  Top 0.305: 77.8,25.48 C26.2 C27.2 | 77.8,23.3 77.8,25.48 | 77.8,23.3 L1.2 | U6.1 78,35.25 78.75,36 79.5,36 80.25,35.25 80.25,30.55 R18.1 77.8,28.1 C27.2 | v77,25.5 77.02,25.48 77.8,25.48 | v77,23.25 77.05,23.3 77.8,23.3 | v77.5,28.75 77.5,28.05 C27.2
USB_VCC_RAW  (via drill 0.25)
  Top 0.305: C25.1 L1.1 v80.5,23.25 | J8.1 77.95,12.2 78.88,13.12 78.88,20.18 C25.1 | v80.5,21 C25.1
USBD+
  Top 0.125: U9.14 72,16.25 74.75,13.5 J8.3
USBD-
  Top 0.125: U9.15 72.5,18 73.65,16.85 75.1,16.85 75.5,17.25 77,17.25 77.75,16.5 77.75,13.25 77.35,12.85 J8.2
WIRELESS_CS  (via drill 0.2)
  Top 0.125: v55.25,27.75 54.5,27.75 52.5,29.75 52.5,33.75 53.6,34.85 53.83,35.08 | 59.75,41 59.64,40.89 | 59.64,40.89 U3.8 | 53.83,35.08 59.64,40.89 | R1.2 53.83,35.08
  Bottom 0.125: v55.25,27.75 55.16,27.84 U1.6
WIRELESS_INT  (via drill 0.2)
  Top 0.125: U3.4 45.61,43.23 51.75,37.09 51.75,28.75 v54.5,26
  Bottom 0.125: U1.9 53.25,26.34 53.59,26 v54.5,26
WIRELESS_RESET  (via drill 0.2)
  Top 0.125: U3.2 47.56,48.31 52.25,43.62 52.25,29.5 v54.5,27.25
  Bottom 0.125: v54.5,27.25 54.41,27.34 U1.7
WIRELESS_VCC
  Top 0.305: U3.10 59.66,45.75 61.25,45.75 62.5,44.5 62.5,39 64.05,37.45 R16.1 74.8,37.45 76.5,35.75 U6.4
WIRELESS_WAKE  (via drill 0.2)
  Top 0.125: U3.3 45.73,45.77 52,39.5 52,29 54.25,26.75 54.75,26.75 v55,26.5
  Bottom 0.125: U1.8 53.5,26.84 53.84,26.5 v55,26.5
WR  (via drill 0.2)
  Top 0.254: v38.75,20.25 34.28,20.25 U4.74
  Bottom 0.125: U1.33 41.34,22.84 v38.75,20.25

### Text on the board
tNames: FPGA | REF | LEDS | GND | MCU LEDS | TCK | TDO | TDI | TMS
200bmp: /Users/alwynster/git/summerProjectHardware/tardis.bmp